# Altium project USB_HUB_VL813.PrjPcb
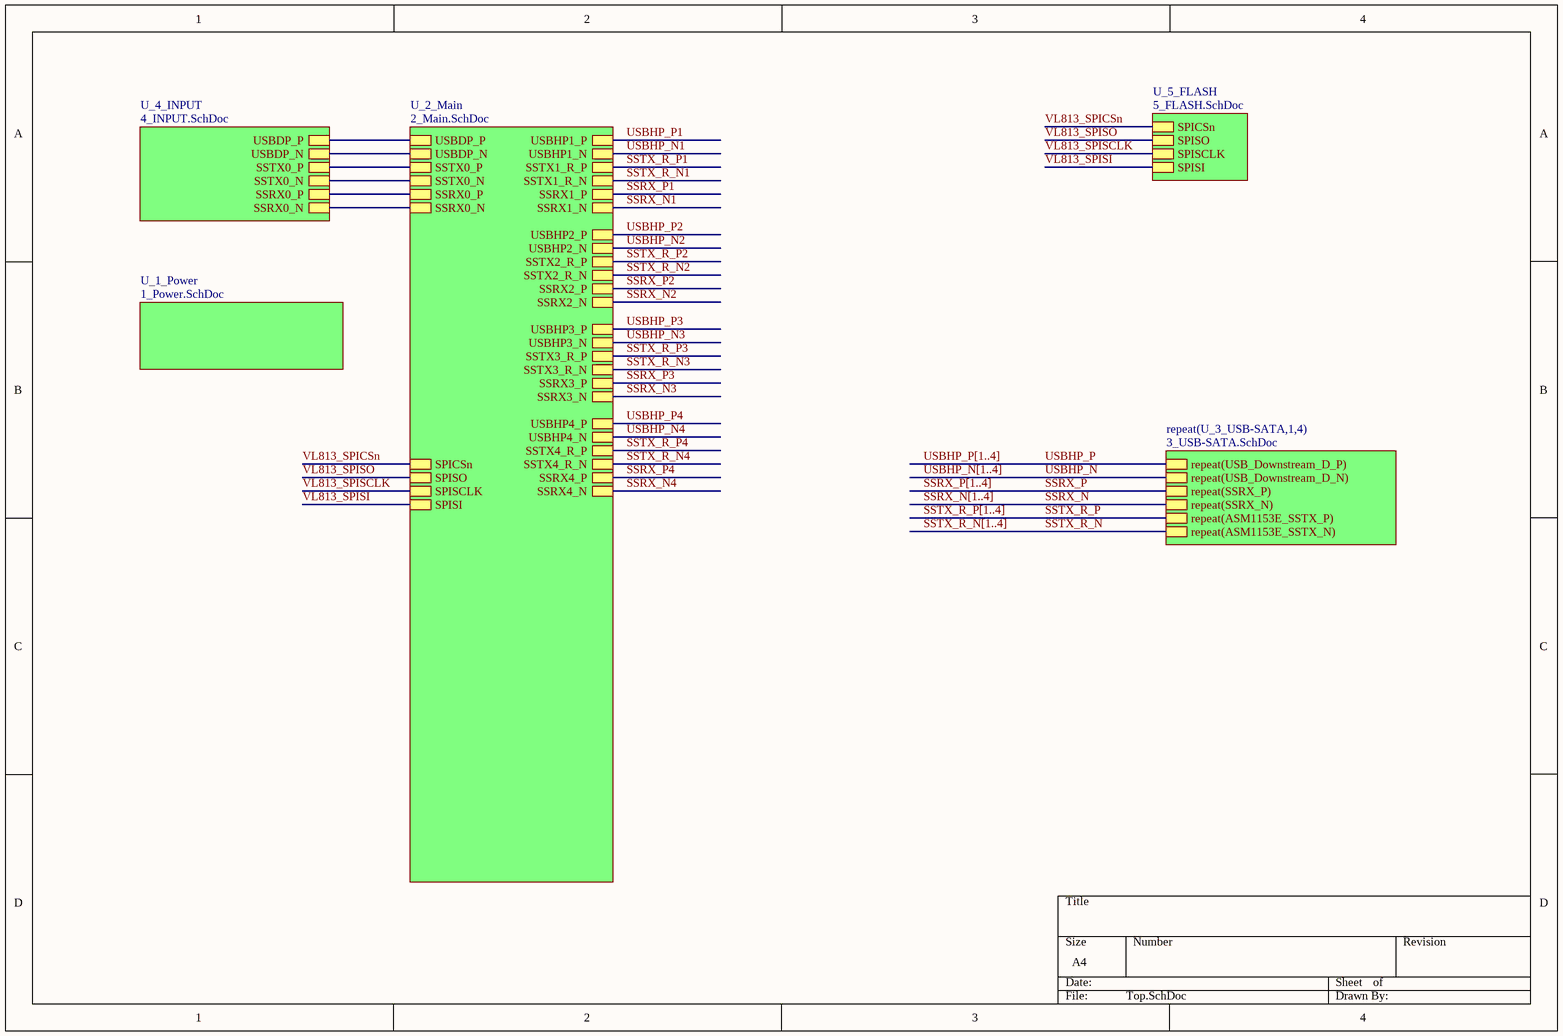
[diagram p0: Top.SchDoc]
6 sheets, 266 parts. Net scope: hierarchical (ports join the sheet entries above them; power ports are global).
Board file: USB_HUB_VL813.PcbDoc
Sheets:
  Top.SchDoc
    U_3_USB-SATA1 = 3_USB-SATA.SchDoc
    U_3_USB-SATA2 = 3_USB-SATA.SchDoc
    U_3_USB-SATA3 = 3_USB-SATA.SchDoc
    U_3_USB-SATA4 = 3_USB-SATA.SchDoc
    U_5_FLASH = 5_FLASH.SchDoc
    U_4_INPUT = 4_INPUT.SchDoc
    U_2_Main = 2_Main.SchDoc
    U_1_Power = 1_Power.SchDoc

## Sheet Top.SchDoc
size A4

### Sub-sheets
repeat(U_3_USB-SATA,1,4) = 3_USB-SATA.SchDoc: repeat(USB_Downstream_D_P), repeat(USB_Downstream_D_N), repeat(ASM1153E_SSTX_P), repeat(ASM1153E_SSTX_N), repeat(SSRX_N), repeat(SSRX_P)
U_1_Power = 1_Power.SchDoc: no entries
U_2_Main = 2_Main.SchDoc: USBHP1_N, USBHP1_P, SSRX1_N, SSRX1_P, SSTX1_R_N, SSTX1_R_P, USBHP2_N, USBHP2_P, SSRX2_N, SSRX2_P, SSTX2_R_N, SSTX2_R_P, USBHP3_N, USBHP3_P, SSRX3_N, SSRX3_P, SSTX3_R_N, SSTX3_R_P, USBHP4_N, USBHP4_P, SSRX4_N, SSRX4_P, SSTX4_R_N, SSTX4_R_P, SPICSn, SPISO, SPISCLK, SPISI, USBDP_P, USBDP_N, SSTX0_N, SSTX0_P, SSRX0_N, SSRX0_P
U_4_INPUT = 4_INPUT.SchDoc: USBDP_P, USBDP_N, SSTX0_N, SSTX0_P, SSRX0_N, SSRX0_P
U_5_FLASH = 5_FLASH.SchDoc: SPICSn, SPISO, SPISCLK, SPISI

### Nets
SSRX0_N: sheet U_4_INPUT/SSRX0_N, sheet U_2_Main/SSRX0_N
SSRX0_P: sheet U_4_INPUT/SSRX0_P, sheet U_2_Main/SSRX0_P
SSRX_N: sheet repeat(U_3_USB-SATA,1,4)/repeat(SSRX_N)
SSRX_P: sheet repeat(U_3_USB-SATA,1,4)/repeat(SSRX_P)
SSTX0_N: sheet U_4_INPUT/SSTX0_N, sheet U_2_Main/SSTX0_N
SSTX0_P: sheet U_4_INPUT/SSTX0_P, sheet U_2_Main/SSTX0_P
SSTX_R_N: sheet repeat(U_3_USB-SATA,1,4)/repeat(ASM1153E_SSTX_N)
SSTX_R_P: sheet repeat(U_3_USB-SATA,1,4)/repeat(ASM1153E_SSTX_P)
USBDP_N: sheet U_4_INPUT/USBDP_N, sheet U_2_Main/USBDP_N
USBDP_P: sheet U_4_INPUT/USBDP_P, sheet U_2_Main/USBDP_P
USBHP_N: sheet repeat(U_3_USB-SATA,1,4)/repeat(USB_Downstream_D_N)
USBHP_P: sheet repeat(U_3_USB-SATA,1,4)/repeat(USB_Downstream_D_P)
VL813_SPICSn: sheet U_5_FLASH/SPICSn, sheet U_2_Main/SPICSn  [project net SPICSn]
VL813_SPISCLK: sheet U_5_FLASH/SPISCLK, sheet U_2_Main/SPISCLK  [project net SPISCLK]
VL813_SPISI: sheet U_5_FLASH/SPISI, sheet U_2_Main/SPISI  [project net SPISI]
VL813_SPISO: sheet U_5_FLASH/SPISO, sheet U_2_Main/SPISO  [project net SPISO]

### Buses and harness runs
bus SSRX_N[1..4]
bus SSRX_P[1..4]
bus SSTX_R_N[1..4]
bus SSTX_R_P[1..4]
bus USBHP_N[1..4]
bus USBHP_P[1..4]

## Sheet 3_USB-SATA.SchDoc
size A2
Used 4 times, as channels U_3_USB-SATA1, U_3_USB-SATA2, U_3_USB-SATA3, U_3_USB-SATA4. Parts and nets are listed once, with the designators drawn on the sheet.
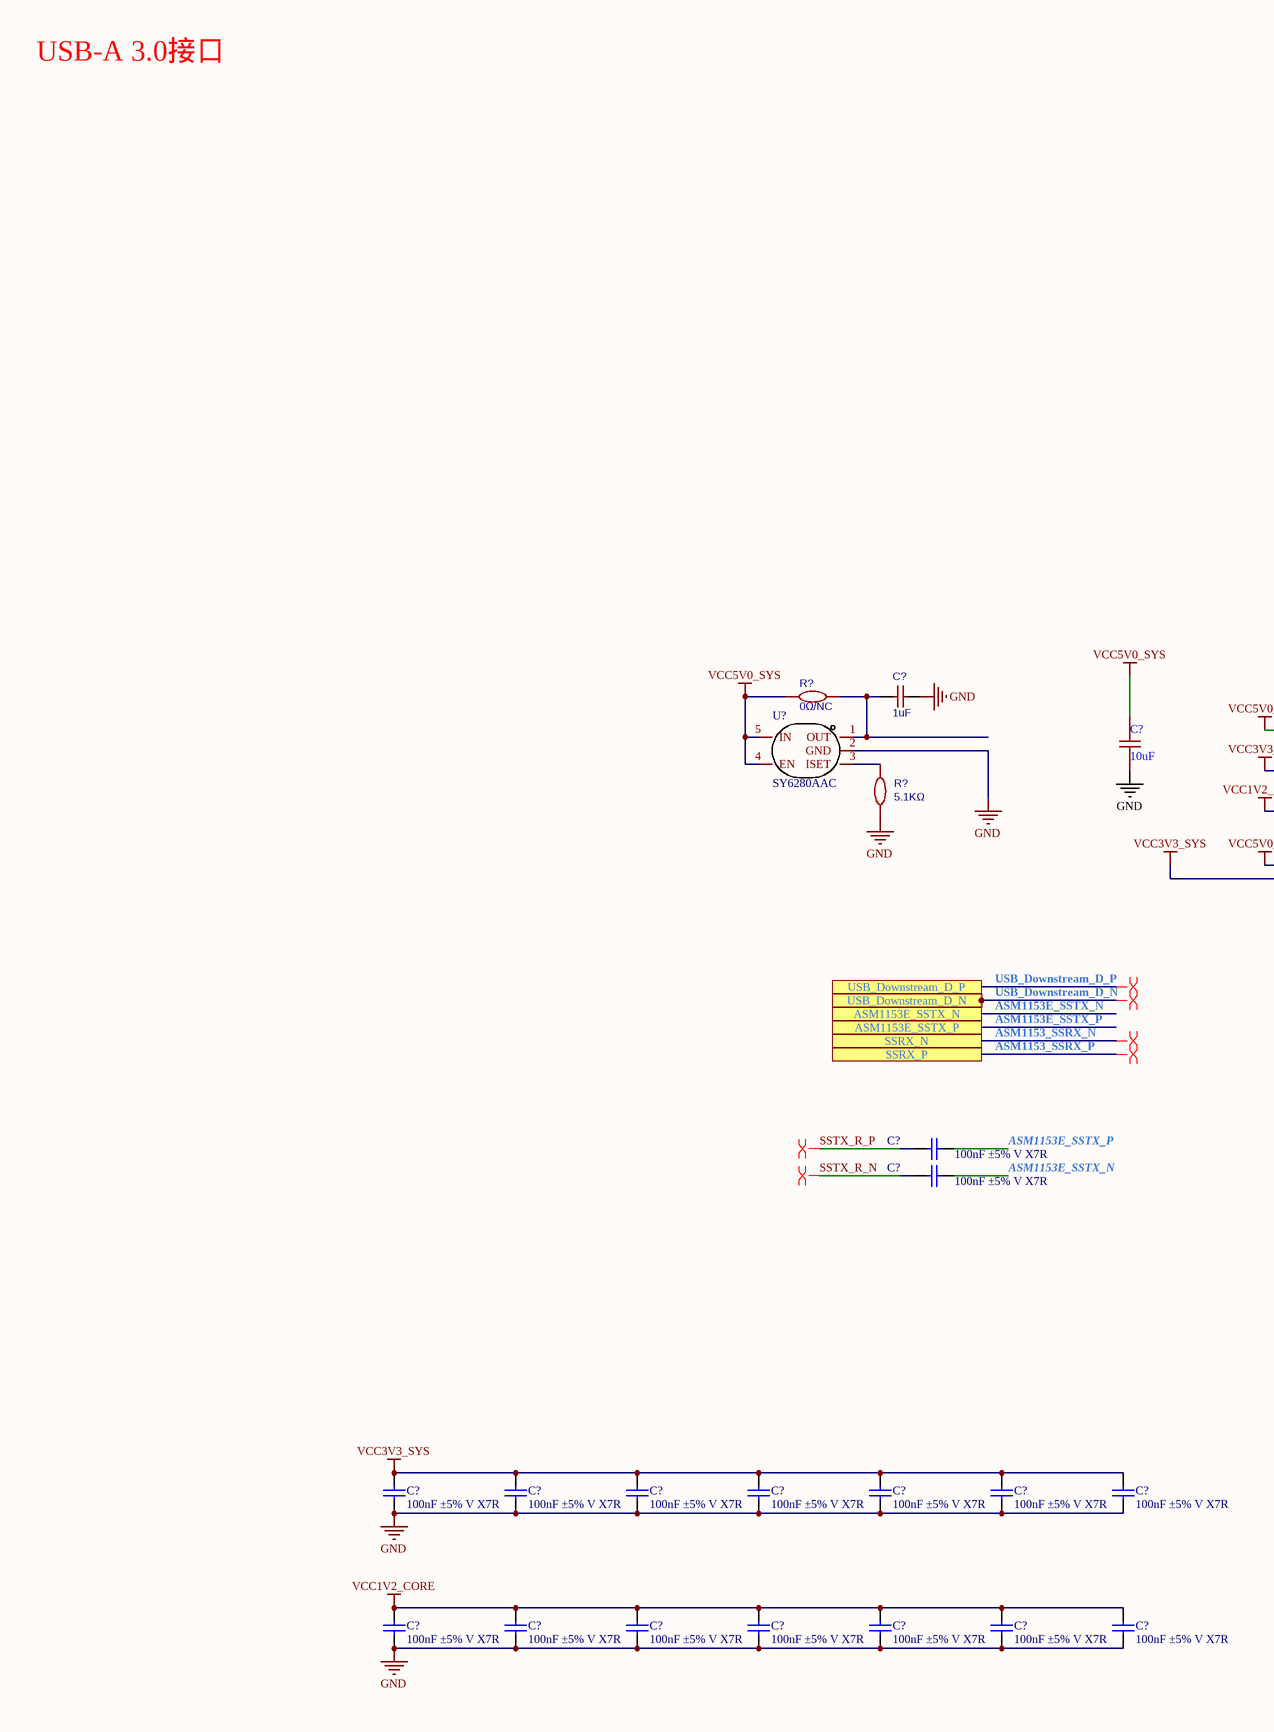
[diagram p1: 3_USB-SATA.SchDoc, left]
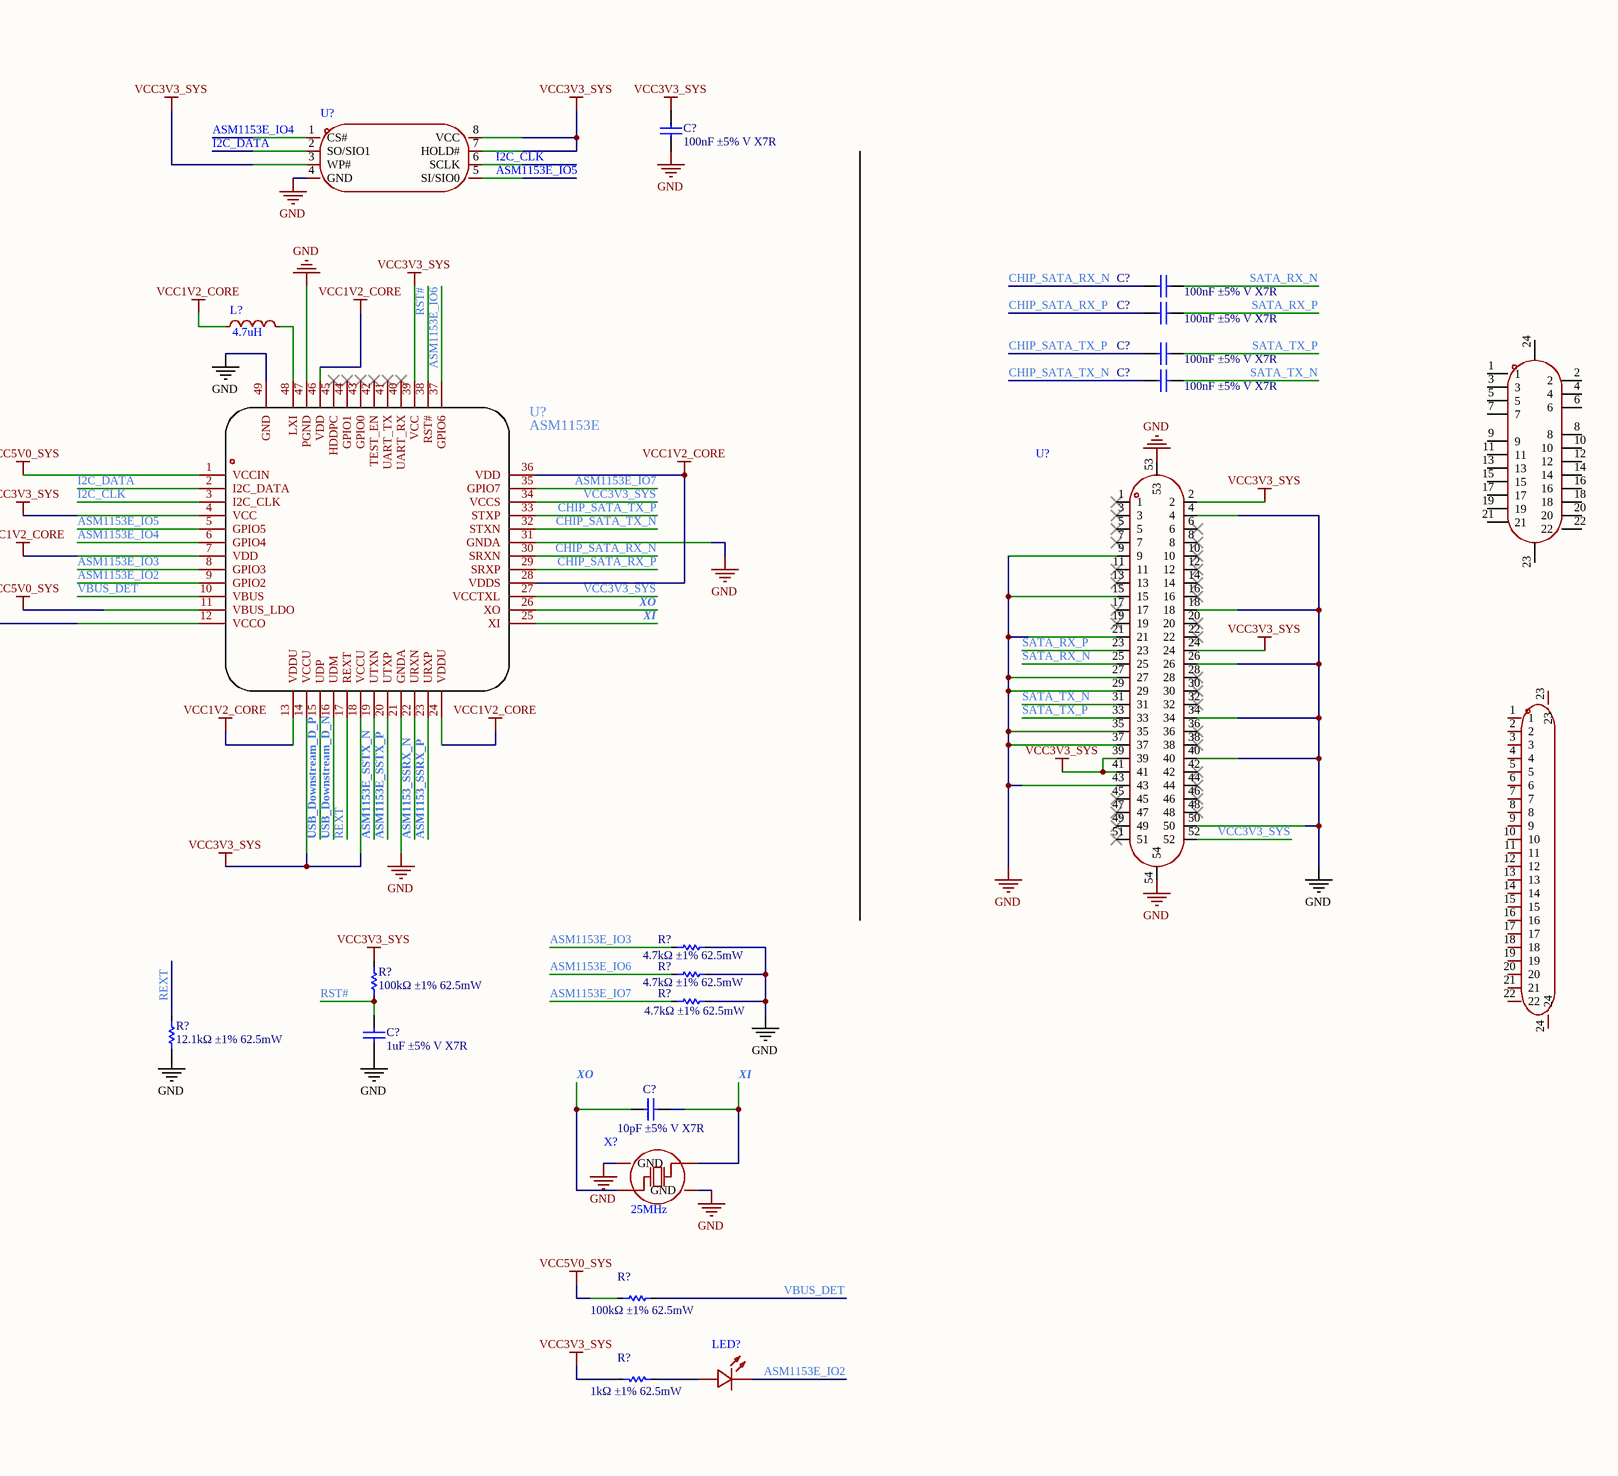
[diagram p2: 3_USB-SATA.SchDoc, right]

### Parts
(Parts that share a designator on the sheet are numbered #1, #2 ... from top to bottom, then left to right.)
C?#1  100nF ±5% V X7R  [C0402]
C?#2  100nF ±5% V X7R  [C0402]
C?#3  100nF ±5% V X7R  [C0402]
C?#4  100nF ±5% V X7R  [C0402]
C?#5  100nF ±5% V X7R  [C0402]
C?#6  1uF  [C0603]
C?#7  10uF  [C0603]
C?#8  100nF ±5% V X7R  [C0402]
C?#9  100nF ±5% V X7R  [C0402]
C?#10  1uF ±5% V X7R  [C0402]
C?#11  10pF ±5% V X7R  [C0402]
C?#12  100nF ±5% V X7R  [C0402]
C?#13  100nF ±5% V X7R  [C0402]
C?#14  100nF ±5% V X7R  [C0402]
C?#15  100nF ±5% V X7R  [C0402]
C?#16  100nF ±5% V X7R  [C0402]
C?#17  100nF ±5% V X7R  [C0402]
C?#18  100nF ±5% V X7R  [C0402]
C?#19  100nF ±5% V X7R  [C0402]
C?#20  100nF ±5% V X7R  [C0402]
C?#21  100nF ±5% V X7R  [C0402]
C?#22  100nF ±5% V X7R  [C0402]
C?#23  100nF ±5% V X7R  [C0402]
C?#24  100nF ±5% V X7R  [C0402]
C?#25  100nF ±5% V X7R  [C0402]
J?#1  HDGCYLSY-SATA-113  [CONN-TH_HDGCYLSY-SATA-113]  (value not drawn)
J?#2  XUTS-2218-0127  [CONN-SMD_SATA7-15-LT]  (value not drawn)
L?  4.7uH  [IND-SMD_L3.0-W3.0-1]
LED?  VLMW1500-GS08  [LED0402-R-RD_WHITE]  (value not drawn)
R?#1  0Ω/NC  [R0603]
R?#2  5.1KΩ  [R0603]
R?#3  4.7kΩ ±1% 62.5mW  [R0402]
R?#4  4.7kΩ ±1% 62.5mW  [R0402]
R?#5  100kΩ ±1% 62.5mW  [R0402]
R?#6  4.7kΩ ±1% 62.5mW  [R0402]
R?#7  12.1kΩ ±1% 62.5mW  [R0402]
R?#8  100kΩ ±1% 62.5mW  [R0402]
R?#9  1kΩ ±1% 62.5mW  [R0402]
U?#1  MX25L512EMI-10G  [SOP-8_L5.0-W4.0-P1.27-LS6.0-BL]  (value not drawn)
U?#2  SY6280AAC  [SOT-23-5_L3.0-W1.7-P0.95-LS2.8-BR]
U?#3  PCIE-52P70H  [PCIE-SMD_52P-P0.80_PCIE-52PXXH]  (value not drawn)
U?#4  ASM1153E  [QFN-48_L6.0-W6.0-P0.40-BL-EP4.2]
X?  25MHz  [CRYSTAL-SMD_4P-L3.2-W2.5-BL]

### Ports
ASM1153E_SSTX_N, ASM1153E_SSTX_P, SSRX_N, SSRX_P, USB_Downstream_D_N, USB_Downstream_D_P

### Nets
GND: C?#1.1 C?#6.1 C?#7.1 C?#10.1 C?#12.1 C?#13.1 C?#14.1 C?#15.1 C?#16.1 C?#17.1 C?#18.1 C?#19.1 C?#20.1 C?#21.1 C?#22.1 C?#23.1 C?#24.1 C?#25.1 R?#2.2 R?#3.1 R?#4.1 R?#6.1 R?#7.1 U?#1.4(GND) U?#2.2(GND) U?#3.4 U?#3.9 U?#3.15 U?#3.18 U?#3.21 U?#3.26 U?#3.27 U?#3.29 U?#3.34 U?#3.35 U?#3.37 U?#3.40 U?#3.43 U?#3.50 U?#3.53 U?#3.54 U?#4.21(GNDA) U?#4.31(GNDA) U?#4.47(PGND) U?#4.49(GND) X?.2(GND) X?.4(GND)
VCC1V2_CORE: C?#19.2 C?#20.2 C?#21.2 C?#22.2 C?#23.2 C?#24.2 C?#25.2 L?.1 U?#4.7(VDD) U?#4.13(VDDU) U?#4.24(VDDU) U?#4.28(VDDS) U?#4.36(VDD) U?#4.46(VDD)
VCC3V3_SYS: C?#1.2 C?#12.2 C?#13.2 C?#14.2 C?#15.2 C?#16.2 C?#17.2 C?#18.2 R?#5.2 R?#9.1 U?#1.3(WP#) U?#1.7(HOLD#) U?#1.8(VCC) U?#3.2 U?#3.24 U?#3.39 U?#3.41 U?#3.52 U?#4.4(VCC) U?#4.12(VCCO) U?#4.14(VCCU) U?#4.18(VCCU) U?#4.27(VCCTXL) U?#4.34(VCCS) U?#4.39(VCC)
VCC5V0_SYS: C?#7.2 R?#1.1 R?#8.2 U?#2.4(EN) U?#2.5(IN) U?#4.1(VCCIN) U?#4.11(VBUS_LDO)
ASM1153_SSRX_N: U?#4.22(URXN) ; port SSRX_N
ASM1153_SSRX_P: U?#4.23(URXP) ; port SSRX_P
ASM1153E_IO2: LED?.2(K) U?#4.9(GPIO2)
ASM1153E_IO3: R?#3.2 U?#4.8(GPIO3)
ASM1153E_IO4: U?#1.1(CS#) U?#4.6(GPIO4)
ASM1153E_IO5: U?#1.5(SI/SIO0) U?#4.5(GPIO5)
ASM1153E_IO6: R?#4.2 U?#4.37(GPIO6)
ASM1153E_IO7: R?#6.2 U?#4.35(GPIO7)
ASM1153E_SSTX_N: C?#9.1 U?#4.19(UTXN) ; port ASM1153E_SSTX_N
ASM1153E_SSTX_P: C?#8.1 U?#4.20(UTXP) ; port ASM1153E_SSTX_P
CHIP_SATA_RX_N: C?#2.2 U?#4.30(SRXN)
CHIP_SATA_RX_P: C?#3.2 U?#4.29(SRXP)
CHIP_SATA_TX_N: C?#5.2 U?#4.32(STXN)
CHIP_SATA_TX_P: C?#4.2 U?#4.33(STXP)
I2C_CLK: U?#1.6(SCLK) U?#4.3(I2C_CLK)
I2C_DATA: U?#1.2(SO/SIO1) U?#4.2(I2C_DATA)
REXT: R?#7.2 U?#4.17(REXT)
RST#: C?#10.2 R?#5.1 U?#4.38(RST#)
SATA_RX_N: C?#2.1 U?#3.25
SATA_RX_P: C?#3.1 U?#3.23
SATA_TX_N: C?#5.1 U?#3.31
SATA_TX_P: C?#4.1 U?#3.33
SSTX_R_N: C?#9.2
SSTX_R_P: C?#8.2
USB_Downstream_D_N: U?#4.16(UDM) ; port USB_Downstream_D_N
USB_Downstream_D_P: U?#4.15(UDP) ; port USB_Downstream_D_P
VBUS_DET: R?#8.1 U?#4.10(VBUS)
XI: C?#11.1 U?#4.25(XI) X?.3(OSC2)
XO: C?#11.2 U?#4.26(XO) X?.1(OSC1)
NetC?#6_2: C?#6.2 R?#1.2 U?#2.1(OUT)
NetL?_2: L?.2 U?#4.48(LXI)
NetLED?_1: LED?.1(A) R?#9.2
NetR?#2_1: R?#2.1 U?#2.3(ISET)

Not connected (* = marked no-connect by the designer): J?#1 1 2 3 4 5 6 7 8 9 10 11 12 13 14 15 16 17 18 19 20 21 22 23 24; J?#2 1 2 3 4 5 6 7 8 9 10 11 12 13 14 15 16 17 18 19 20 21 22 23 24; U?#3 1* 3* 5* 6* 7* 8* 10* 11* 12* 13* 14* 16* 17* 19* 20* 22* 28* 30* 32* 36* 38* 42* 44* 45* 46* 47* 48* 49* 51*; U?#4 40(UART_RX)* 41(UART_TX)* 42(TEST_EN)* 43(GPIO0)* 44(GPIO1)* 45(HDDPC)*

### Channels
U_3_USB-SATA1: designators C?=C?_U_3_USB-SATA1#6 C?=C?_U_3_USB-SATA1#7 C?=C?_U_3_USB-SATA1#15 C?=C?_U_3_USB-SATA1#16 C?=C?_U_3_USB-SATA1#17 C?=C?_U_3_USB-SATA1#18 C?=C?_U_3_USB-SATA1#12 C?=C?_U_3_USB-SATA1#13 C?=C?_U_3_USB-SATA1#14 C?=C?_U_3_USB-SATA1#23 C?=C?_U_3_USB-SATA1#24 C?=C?_U_3_USB-SATA1#25 C?=C?_U_3_USB-SATA1#20 C?=C?_U_3_USB-SATA1#21 C?=C?_U_3_USB-SATA1#22 C?=C?_U_3_USB-SATA1#19 C?=C?_U_3_USB-SATA1#8 C?=C?_U_3_USB-SATA1#9 C?=C?_U_3_USB-SATA1#10 C?=C?_U_3_USB-SATA1#11 C?=C?_U_3_USB-SATA1#2 C?=C?_U_3_USB-SATA1#3 C?=C?_U_3_USB-SATA1#4 C?=C?_U_3_USB-SATA1#5 C?=C?_U_3_USB-SATA1#1 J?=J?_U_3_USB-SATA1#1 J?=J?_U_3_USB-SATA1#2 L?=L?_U_3_USB-SATA1 LED?=LED?_U_3_USB-SATA1 R?=R?_U_3_USB-SATA1#2 R?=R?_U_3_USB-SATA1#1 R?=R?_U_3_USB-SATA1#7 R?=R?_U_3_USB-SATA1#5 R?=R?_U_3_USB-SATA1#3 R?=R?_U_3_USB-SATA1#4 R?=R?_U_3_USB-SATA1#6 R?=R?_U_3_USB-SATA1#8 R?=R?_U_3_USB-SATA1#9 U?=U?_U_3_USB-SATA1#2 U?=U?_U_3_USB-SATA1#3 U?=U?_U_3_USB-SATA1#4 U?=U?_U_3_USB-SATA1#1 X?=X?_U_3_USB-SATA1; ports ASM1153E_SSTX_N=ASM1153E_SSTX_N ASM1153E_SSTX_P=ASM1153E_SSTX_P SSRX_N=ASM1153_SSRX_N SSRX_P=ASM1153_SSRX_P USB_Downstream_D_N=USB_Downstream_D_N USB_Downstream_D_P=USB_Downstream_D_P
U_3_USB-SATA2: designators C?=C?_U_3_USB-SATA2#6 C?=C?_U_3_USB-SATA2#7 C?=C?_U_3_USB-SATA2#15 C?=C?_U_3_USB-SATA2#16 C?=C?_U_3_USB-SATA2#17 C?=C?_U_3_USB-SATA2#18 C?=C?_U_3_USB-SATA2#12 C?=C?_U_3_USB-SATA2#13 C?=C?_U_3_USB-SATA2#14 C?=C?_U_3_USB-SATA2#23 C?=C?_U_3_USB-SATA2#24 C?=C?_U_3_USB-SATA2#25 C?=C?_U_3_USB-SATA2#20 C?=C?_U_3_USB-SATA2#21 C?=C?_U_3_USB-SATA2#22 C?=C?_U_3_USB-SATA2#19 C?=C?_U_3_USB-SATA2#8 C?=C?_U_3_USB-SATA2#9 C?=C?_U_3_USB-SATA2#10 C?=C?_U_3_USB-SATA2#11 C?=C?_U_3_USB-SATA2#2 C?=C?_U_3_USB-SATA2#3 C?=C?_U_3_USB-SATA2#4 C?=C?_U_3_USB-SATA2#5 C?=C?_U_3_USB-SATA2#1 J?=J?_U_3_USB-SATA2#1 J?=J?_U_3_USB-SATA2#2 L?=L?_U_3_USB-SATA2 LED?=LED?_U_3_USB-SATA2 R?=R?_U_3_USB-SATA2#2 R?=R?_U_3_USB-SATA2#1 R?=R?_U_3_USB-SATA2#7 R?=R?_U_3_USB-SATA2#5 R?=R?_U_3_USB-SATA2#3 R?=R?_U_3_USB-SATA2#4 R?=R?_U_3_USB-SATA2#6 R?=R?_U_3_USB-SATA2#8 R?=R?_U_3_USB-SATA2#9 U?=U?_U_3_USB-SATA2#2 U?=U?_U_3_USB-SATA2#3 U?=U?_U_3_USB-SATA2#4 U?=U?_U_3_USB-SATA2#1 X?=X?_U_3_USB-SATA2; ports ASM1153E_SSTX_N=ASM1153E_SSTX_N ASM1153E_SSTX_P=ASM1153E_SSTX_P SSRX_N=ASM1153_SSRX_N SSRX_P=ASM1153_SSRX_P USB_Downstream_D_N=USB_Downstream_D_N USB_Downstream_D_P=USB_Downstream_D_P
U_3_USB-SATA3: designators C?=C?_U_3_USB-SATA3#6 C?=C?_U_3_USB-SATA3#7 C?=C?_U_3_USB-SATA3#15 C?=C?_U_3_USB-SATA3#16 C?=C?_U_3_USB-SATA3#17 C?=C?_U_3_USB-SATA3#18 C?=C?_U_3_USB-SATA3#12 C?=C?_U_3_USB-SATA3#13 C?=C?_U_3_USB-SATA3#14 C?=C?_U_3_USB-SATA3#23 C?=C?_U_3_USB-SATA3#24 C?=C?_U_3_USB-SATA3#25 C?=C?_U_3_USB-SATA3#20 C?=C?_U_3_USB-SATA3#21 C?=C?_U_3_USB-SATA3#22 C?=C?_U_3_USB-SATA3#19 C?=C?_U_3_USB-SATA3#8 C?=C?_U_3_USB-SATA3#9 C?=C?_U_3_USB-SATA3#10 C?=C?_U_3_USB-SATA3#11 C?=C?_U_3_USB-SATA3#2 C?=C?_U_3_USB-SATA3#3 C?=C?_U_3_USB-SATA3#4 C?=C?_U_3_USB-SATA3#5 C?=C?_U_3_USB-SATA3#1 J?=J?_U_3_USB-SATA3#1 J?=J?_U_3_USB-SATA3#2 L?=L?_U_3_USB-SATA3 LED?=LED?_U_3_USB-SATA3 R?=R?_U_3_USB-SATA3#2 R?=R?_U_3_USB-SATA3#1 R?=R?_U_3_USB-SATA3#7 R?=R?_U_3_USB-SATA3#5 R?=R?_U_3_USB-SATA3#3 R?=R?_U_3_USB-SATA3#4 R?=R?_U_3_USB-SATA3#6 R?=R?_U_3_USB-SATA3#8 R?=R?_U_3_USB-SATA3#9 U?=U?_U_3_USB-SATA3#2 U?=U?_U_3_USB-SATA3#3 U?=U?_U_3_USB-SATA3#4 U?=U?_U_3_USB-SATA3#1 X?=X?_U_3_USB-SATA3; ports ASM1153E_SSTX_N=ASM1153E_SSTX_N ASM1153E_SSTX_P=ASM1153E_SSTX_P SSRX_N=ASM1153_SSRX_N SSRX_P=ASM1153_SSRX_P USB_Downstream_D_N=USB_Downstream_D_N USB_Downstream_D_P=USB_Downstream_D_P
U_3_USB-SATA4: designators C?=C?_U_3_USB-SATA4#6 C?=C?_U_3_USB-SATA4#7 C?=C?_U_3_USB-SATA4#15 C?=C?_U_3_USB-SATA4#16 C?=C?_U_3_USB-SATA4#17 C?=C?_U_3_USB-SATA4#18 C?=C?_U_3_USB-SATA4#12 C?=C?_U_3_USB-SATA4#13 C?=C?_U_3_USB-SATA4#14 C?=C?_U_3_USB-SATA4#23 C?=C?_U_3_USB-SATA4#24 C?=C?_U_3_USB-SATA4#25 C?=C?_U_3_USB-SATA4#20 C?=C?_U_3_USB-SATA4#21 C?=C?_U_3_USB-SATA4#22 C?=C?_U_3_USB-SATA4#19 C?=C?_U_3_USB-SATA4#8 C?=C?_U_3_USB-SATA4#9 C?=C?_U_3_USB-SATA4#10 C?=C?_U_3_USB-SATA4#11 C?=C?_U_3_USB-SATA4#2 C?=C?_U_3_USB-SATA4#3 C?=C?_U_3_USB-SATA4#4 C?=C?_U_3_USB-SATA4#5 C?=C?_U_3_USB-SATA4#1 J?=J?_U_3_USB-SATA4#1 J?=J?_U_3_USB-SATA4#2 L?=L?_U_3_USB-SATA4 LED?=LED?_U_3_USB-SATA4 R?=R?_U_3_USB-SATA4#2 R?=R?_U_3_USB-SATA4#1 R?=R?_U_3_USB-SATA4#7 R?=R?_U_3_USB-SATA4#5 R?=R?_U_3_USB-SATA4#3 R?=R?_U_3_USB-SATA4#4 R?=R?_U_3_USB-SATA4#6 R?=R?_U_3_USB-SATA4#8 R?=R?_U_3_USB-SATA4#9 U?=U?_U_3_USB-SATA4#2 U?=U?_U_3_USB-SATA4#3 U?=U?_U_3_USB-SATA4#4 U?=U?_U_3_USB-SATA4#1 X?=X?_U_3_USB-SATA4; ports ASM1153E_SSTX_N=ASM1153E_SSTX_N ASM1153E_SSTX_P=ASM1153E_SSTX_P SSRX_N=ASM1153_SSRX_N SSRX_P=ASM1153_SSRX_P USB_Downstream_D_N=USB_Downstream_D_N USB_Downstream_D_P=USB_Downstream_D_P

### Layout directives
differential pair: ASM1153_SSRX_N, ASM1153_SSRX_P, SSTX_R_N_U_3_USB-SATA1, SSTX_R_P_U_3_USB-SATA1, USB_Downstream_D_N, USB_Downstream_D_P

### Notes on the sheet
- USB-A 3.0接口

### Library data of the parts
C?#1-C?#5 C?#8-C?#25 = C0402: Capacitor; Published: 8-Jun-2000; LatestRevisionDate: 17-Jul-2002; LatestRevisionNote: Re-released for DXP Platform.; PackageReference: RAD-0.3; Publisher: Altium Limited; PackageDescription: Radial Cap, Thru-Hole; 2 Leads; 0.3 in Pin Spacing
C?#6 = C: BOM_Manufacturer: FH; BOM_Manufacturer Part: 0603F104M500NT; nameAlias: Capacitance; BOM_Supplier: LCSC; BOM_Supplier Part: C42998; BOM_JLCPCB Part Class: Extended Part; spicePre: C; spiceSymbolName: 0603F104M500NT
C?#7 = CL10A106KP8NNNC: Manufacturer: SAMSUNG(三星); Add into BOM: yes; Tolerance: ±10%; Voltage Rated: 10V; Temperature Coefficient: X5R; Symbol: CL10A106KP8NNNC; Device: CL10A106KP8NNNC; LCSC Part Name: 10uF ±10% 10V; Supplier Part: C19702; Manufacturer Part: CL10A106KP8NNNC; Supplier Footprint: 0603; JLCPCB Part Class: Basic Part; Datasheet: https://atta.szlcsc.com/upload/public/pdf/source/20160103/1457707703378.pdf; Supplier: LCSC; Convert to PCB: yes; Value: 10uF
J?#1 = SATA-22P: Manufacturer: HDGC(华德共创); Add into BOM: yes; Interface Form: SATA; Connector Type: 母; Supplementary Features: 鱼叉脚(金属); Symbol: HDGCYLSY-SATA-113; Device: HDGCYLSY-SATA-113; LCSC Part Name: HDGCYLSY-SATA-113; Supplier Part: C22438715; Manufacturer Part: HDGCYLSY-SATA-113; Supplier Footprint: 插件; JLCPCB Part Class: Extended Part; Datasheet: https://atta.szlcsc.com/upload/public/pdf/source/20240523/CC8F1A74D84556CFB703F6AD7368385F.pdf; Supplier: LCSC; Convert to PCB: yes; Number of Pins: 22P; Mounting Style: 直插; Body Height: -; Operating Temperature Range: -
J?#2 = SATA-22P_1: Manufacturer: LX(连欣科技); Add into BOM: yes; Symbol: XUTS-2218-0127; Device: XUTS-2218-0127; LCSC Part Name: XUTS-2218-0127; Supplier Part: C19193804; Manufacturer Part: XUTS-2218-0127; Supplier Footprint: SMD,P=1.27mm; JLCPCB Part Class: Extended Part; Datasheet: https://atta.szlcsc.com/upload/public/pdf/source/20231117/B34EFEA7383D9ABF34D19E7DB42C8BB5.pdf; Supplier: LCSC; Convert to PCB: yes
L? = CKCS3012-4.7uH/M: Manufacturer: CENKER(岑科); Add into BOM: yes; Tolerance: ±20%; Rated Current: 1.24A; DC Resistance (DCR): 120mΩ; Symbol: CKCS3012-4.7UH/M; Device: CKCS3012-4.7uH/M; LCSC Part Name: 4.7uH ±20% 1.24A 120mΩ; Supplier Part: C354557; Manufacturer Part: CKCS3012-4.7uH/M; Supplier Footprint: SMD; JLCPCB Part Class: Extended Part; Datasheet: https://atta.szlcsc.com/upload/public/pdf/source/20190115/C354557_61A3705615E4FADB9C94D2137EE09B6B.pdf; Supplier: LCSC; Convert to PCB: yes; Value: 4.7uH
LED? = VLMW1500-GS08: Manufacturer: VISHAY(威世); Add into BOM: yes; Emitted Color: 白灯; Forward Current: 5mA; Forward Voltage (VF): 2.9V; Luminous Intensity: 90mcd; Power Dissipation: 70mW; Symbol: VLMW1500-GS08; Device: VLMW1500-GS08; LCSC Part Name: 白灯; Supplier Part: C511379; Manufacturer Part: VLMW1500-GS08; Supplier Footprint: 0402; JLCPCB Part Class: Extended Part; Datasheet: https://atta.szlcsc.com/upload/public/pdf/source/20200408/C511379_C2F59698F604A60E2C48FD851172BBA0.pdf; Supplier: LCSC; Convert to PCB: yes; Diode Configuration: -; Lens Color: -; Dominant Wavelength: -; Peak Wavelength: -; Color Temperature: -; Luminous Flux (@25℃): -; Viewing Angle: -; Mounting Sytle: -; Operating Temperature: -30~+80
R?#1 R?#2 = R: BOM_Manufacturer: Guangdong Fenghua Advanced Tech; BOM_Manufacturer Part: RS-03K1002FT; Resistance (Ohms): 10K; nameAlias: Resistance; Contributor: LCSC; BOM_Supplier: LCSC; BOM_Supplier Part: C115324; spicePre: R; spiceSymbolName: RS-03K1002FT
R?#3-R?#9 = R0402: Resistor; Published: 8-Jun-2000; LatestRevisionDate: 17-Jul-2002; LatestRevisionNote: Re-released for DXP Platform.; PackageReference: AXIAL-0.3; Publisher: Altium Limited; PackageDescription: Axial Device, Thru-Hole; 2 Leads; 0.3 in Pin Spacing
U?#1 = MX25L512EMI-10G: Manufacturer: MXIC(旺宏电子); Symbol: MX25L512EMI-10G_C2803023; Add into BOM: yes; Device: MX25L512EMI-10G; LCSC Part Name: MX25L512EMI-10G; Supplier Part: C2803023; Manufacturer Part: MX25L512EMI-10G; Supplier Footprint: SOP-8; JLCPCB Part Class: Extended Part; Datasheet: https://atta.szlcsc.com/upload/public/pdf/source/20210906/B454D1B9C39ED3C00F3164A690CF7DD8.pdf; Supplier: LCSC; Convert to PCB: yes
U?#3 = PCIE-52P70H: Manufacturer: XUNPU(讯普); Symbol: PCIE-52P70H_C2982554; Add into BOM: yes; Device: PCIE-52P70H; LCSC Part Name: PCIE-52P70H; Supplier Part: C2982554; Manufacturer Part: PCIE-52P70H; Supplier Footprint: SMD; JLCPCB Part Class: Extended Part; Datasheet: https://atta.szlcsc.com/upload/public/pdf/source/20220311/DC8B167F9A8E29C645B8AA97E9059897.pdf; Supplier: LCSC; Convert to PCB: yes
U?#4 = ASM1153E: USB3.0 to SATA Bridge Controller; Add into BOM: yes; Symbol: ASM1153E; Device: ASM1153E; LCSC Part Name: ASM1153E; Supplier Part: C2762919; Manufacturer Part: ASM1153E; Supplier Footprint: LQFN-48_EP_6.0x6.0x0.4P; JLCPCB Part Class: Extended Part; Datasheet: 2021-03-22/601605W/2276bd4a79cf4165b237c0c17b58d9ef/ASM1153Datasheetv1_1.pdf; Supplier: LCSC; Convert to PCB: yes
X? = X1E0000210621: Manufacturer: EPSON(爱普生); Add into BOM: yes; Crystal Type: 贴片无源晶振; Frequency Tolerance: ±10ppm; Load Capacitance: 9pF; Equivalent Series Resistance (ESR): 40Ω; Symbol: X1E0000210621; Device: X1E0000210621; LCSC Part Name: 25MHz ±10ppm 9pF; Supplier Part: C255920; Manufacturer Part: X1E0000210621; Supplier Footprint: SMD3225-4P; JLCPCB Part Class: Extended Part; Datasheet: https://atta.szlcsc.com/upload/public/pdf/source/20180822/C255920_F9528E19433D1B377CB88CCBF483E490.pdf; Supplier: LCSC; Convert to PCB: yes; Value: 25MHz; Frequency Stability: -; Operating Temperature: -40~+85

## Sheet 5_FLASH.SchDoc
size A4
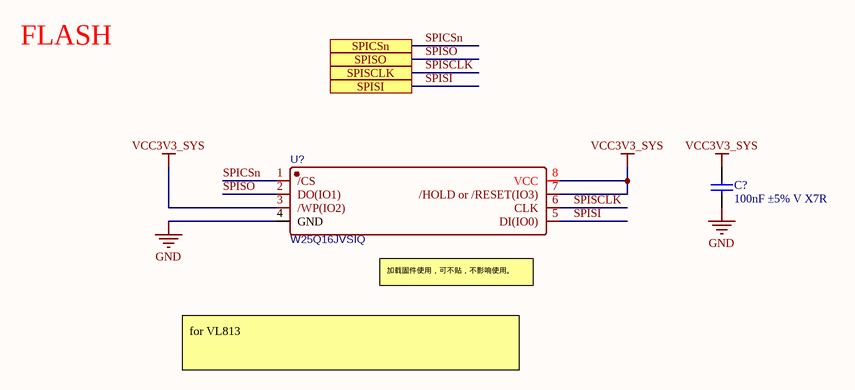
[diagram p3: 5_FLASH.SchDoc]

### Parts
(Parts that share a designator on the sheet are numbered #1, #2 ... from top to bottom, then left to right.)
C?#1  100nF ±5% V X7R  [C0402]
U?#1  W25Q16JVSIQ  [SOIC-8_L5.3-W5.3-P1.27-LS8.0-BL]

### Ports
SPICSn, SPISCLK, SPISI, SPISO

### Nets
GND: C?#1.1 U?#1.4(GND)
VCC3V3_SYS: C?#1.2 U?#1.3(/WP(IO2)) U?#1.7(/HOLD_or_/RESET(IO3)) U?#1.8(VCC)
SPICSn: U?#1.1(/CS) ; port SPICSn
SPISCLK: U?#1.6(CLK) ; port SPISCLK
SPISI: U?#1.5(DI(IO0)) ; port SPISI
SPISO: U?#1.2(DO(IO1)) ; port SPISO

### Notes on the sheet
- FLASH
- (near U?#1) 加载固件使用，可不贴，不影响使用。
- for VL813

### Library data of the parts
C?#1 = C0402: Capacitor; Published: 8-Jun-2000; LatestRevisionDate: 17-Jul-2002; LatestRevisionNote: Re-released for DXP Platform.; PackageReference: RAD-0.3; Publisher: Altium Limited; PackageDescription: Radial Cap, Thru-Hole; 2 Leads; 0.3 in Pin Spacing
U?#1 = W25Q16FWSSIQ: BOM_Manufacturer: Winbond Elec; Contributor: LCSC; BOM_Supplier: LCSC; BOM_Supplier Part: C377629; BOM_Manufacturer Part: W25Q16FWSSIQ; BOM_JLCPCB Part Class: Extended Part; spicePre: U; spiceSymbolName: W25Q16FWSSIQ

## Sheet 4_INPUT.SchDoc
size A4
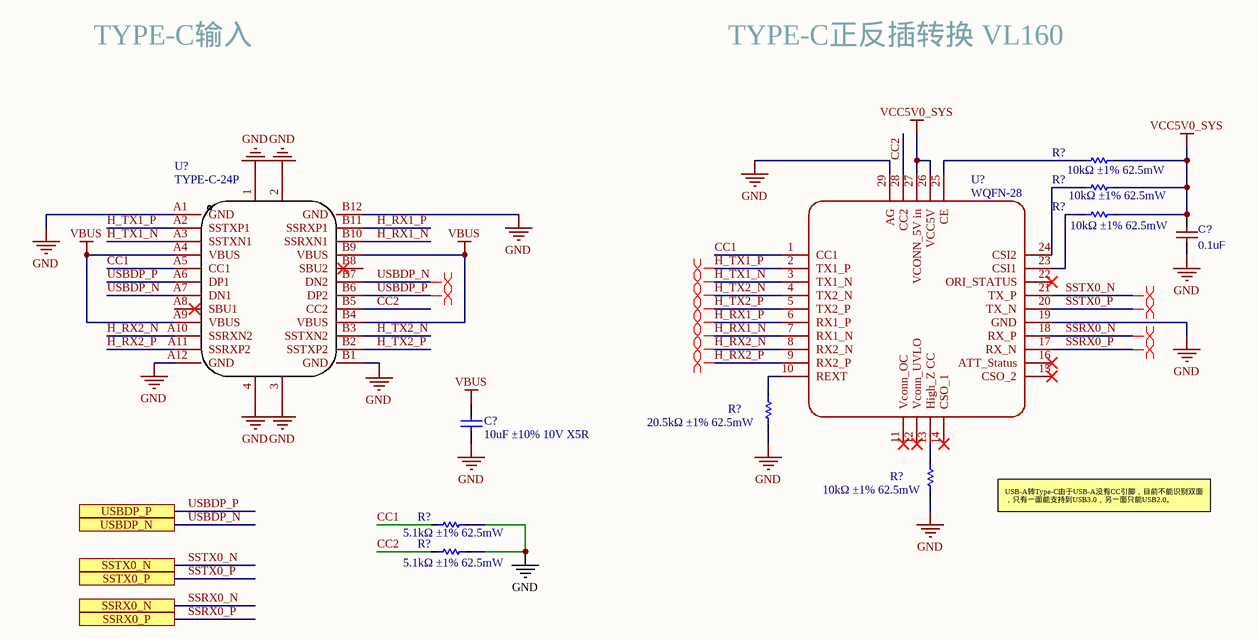
[diagram p4: 4_INPUT.SchDoc]

### Parts
(Parts that share a designator on the sheet are numbered #1, #2 ... from top to bottom, then left to right.)
C?#2  0.1uF  [C0603]
C?#3  10uF ±10% 10V X5R  [C0603]
R?#1  10kΩ ±1% 62.5mW  [R0402]
R?#2  10kΩ ±1% 62.5mW  [R0402]
R?#3  10kΩ ±1% 62.5mW  [R0402]
R?#4  20.5kΩ ±1% 62.5mW  [R0402]
R?#5  10kΩ ±1% 62.5mW  [R0402]
R?#6  5.1kΩ ±1% 62.5mW  [R0402]
R?#7  5.1kΩ ±1% 62.5mW  [R0402]
U?#2  TYPE-C-24P  [TYPE-C-24P]
U?#3  WQFN-28  [WQFN-28]

### Ports
SSRX0_N, SSRX0_P, SSTX0_N, SSTX0_P, USBDP_N, USBDP_P

### Nets
GND: C?#2.2 C?#3.1 R?#4.2 R?#5.2 R?#6.1 R?#7.1 U?#2.1 U?#2.2 U?#2.3 U?#2.4 U?#2.A1(GND) U?#2.A12(GND) U?#2.B1(GND) U?#2.B12(GND) U?#3.19(GND) U?#3.29(AG)
VBUS: C?#3.2 U?#2.A4(VBUS) U?#2.A9(VBUS) U?#2.B4(VBUS) U?#2.B9(VBUS)
VCC5V0_SYS: C?#2.1 R?#1.2 R?#2.2 R?#3.2 U?#3.26(VCC5V) U?#3.27(VCONN_5V_in)
CC1: R?#6.2 U?#2.A5(CC1) U?#3.1(CC1)
CC2: R?#7.2 U?#2.B5(CC2) U?#3.28(CC2)
H_RX1_N: U?#2.B10(SSRXN1) U?#3.7(RX1_N)
H_RX1_P: U?#2.B11(SSRXP1) U?#3.6(RX1_P)
H_RX2_N: U?#2.A10(SSRXN2) U?#3.8(RX2_N)
H_RX2_P: U?#2.A11(SSRXP2) U?#3.9(RX2_P)
H_TX1_N: U?#2.A3(SSTXN1) U?#3.3(TX1_N)
H_TX1_P: U?#2.A2(SSTXP1) U?#3.2(TX1_P)
H_TX2_N: U?#2.B3(SSTXN2) U?#3.4(TX2_N)
H_TX2_P: U?#2.B2(SSTXP2) U?#3.5(TX2_P)
SSRX0_N: U?#3.18(RX_P) ; port SSRX0_N
SSRX0_P: U?#3.17(RX_N) ; port SSRX0_P
SSTX0_N: U?#3.21(TX_P) ; port SSTX0_N
SSTX0_P: U?#3.20(TX_N) ; port SSTX0_P
USBDP_N: U?#2.A7(DN1) U?#2.B7(DN2) ; port USBDP_N
USBDP_P: U?#2.A6(DP1) U?#2.B6(DP2) ; port USBDP_P
NetR?#1_1: R?#1.1 U?#3.25(CE)
NetR?#2_1: R?#2.1 U?#3.24(CSI2)
NetR?#3_1: R?#3.1 U?#3.23(CSI1)
NetR?#4_1: R?#4.1 U?#3.10(REXT)
NetR?#5_1: R?#5.1 U?#3.13(High_Z_CC)

Not connected (* = marked no-connect by the designer): U?#2 A8(SBU1) B8(SBU2); U?#3 11(Vconn_OC)* 12(Vconn_UVLO)* 14(CSO_1)* 15(CSO_2)* 16(ATT_Status)* 22(ORI_STATUS)*

### Layout directives
differential pair: H_RX1_N, H_RX1_P, H_RX2_N, H_RX2_P, H_TX1_N, H_TX1_P, H_TX2_N, H_TX2_P, SSRX0_N, SSRX0_P, SSTX0_N, SSTX0_P, USBDP_N, USBDP_P

### Notes on the sheet
- TYPE-C输入
- TYPE-C正反插转换 VL160
- USB-A转Type-C由于USB-A没有CC引脚，目前不能识别双面，只有一面能支持到USB3.0，另一面只能USB2.0。

### Library data of the parts
C?#2 = C: as C?#6 on sheet 3_USB-SATA; BOM_Supplier: LCSC; BOM_Supplier Part: C42998; BOM_JLCPCB Part Class: Extended Part; spicePre: C; spiceSymbolName: 0603F104M500NT
C?#3 = C0603: Capacitor; Published: 8-Jun-2000; LatestRevisionDate: 17-Jul-2002; LatestRevisionNote: Re-released for DXP Platform.; PackageReference: RAD-0.3; Publisher: Altium Limited; PackageDescription: Radial Cap, Thru-Hole; 2 Leads; 0.3 in Pin Spacing
R?#1-R?#7 = R0402: Resistor; Published: 8-Jun-2000; LatestRevisionDate: 17-Jul-2002; LatestRevisionNote: Re-released for DXP Platform.; PackageReference: AXIAL-0.3; Publisher: Altium Limited; PackageDescription: Axial Device, Thru-Hole; 2 Leads; 0.3 in Pin Spacing
U?#3 = VL160
U?#2 = TYPE-C-24P: Parameter 1: *

## Sheet 2_Main.SchDoc
size A3
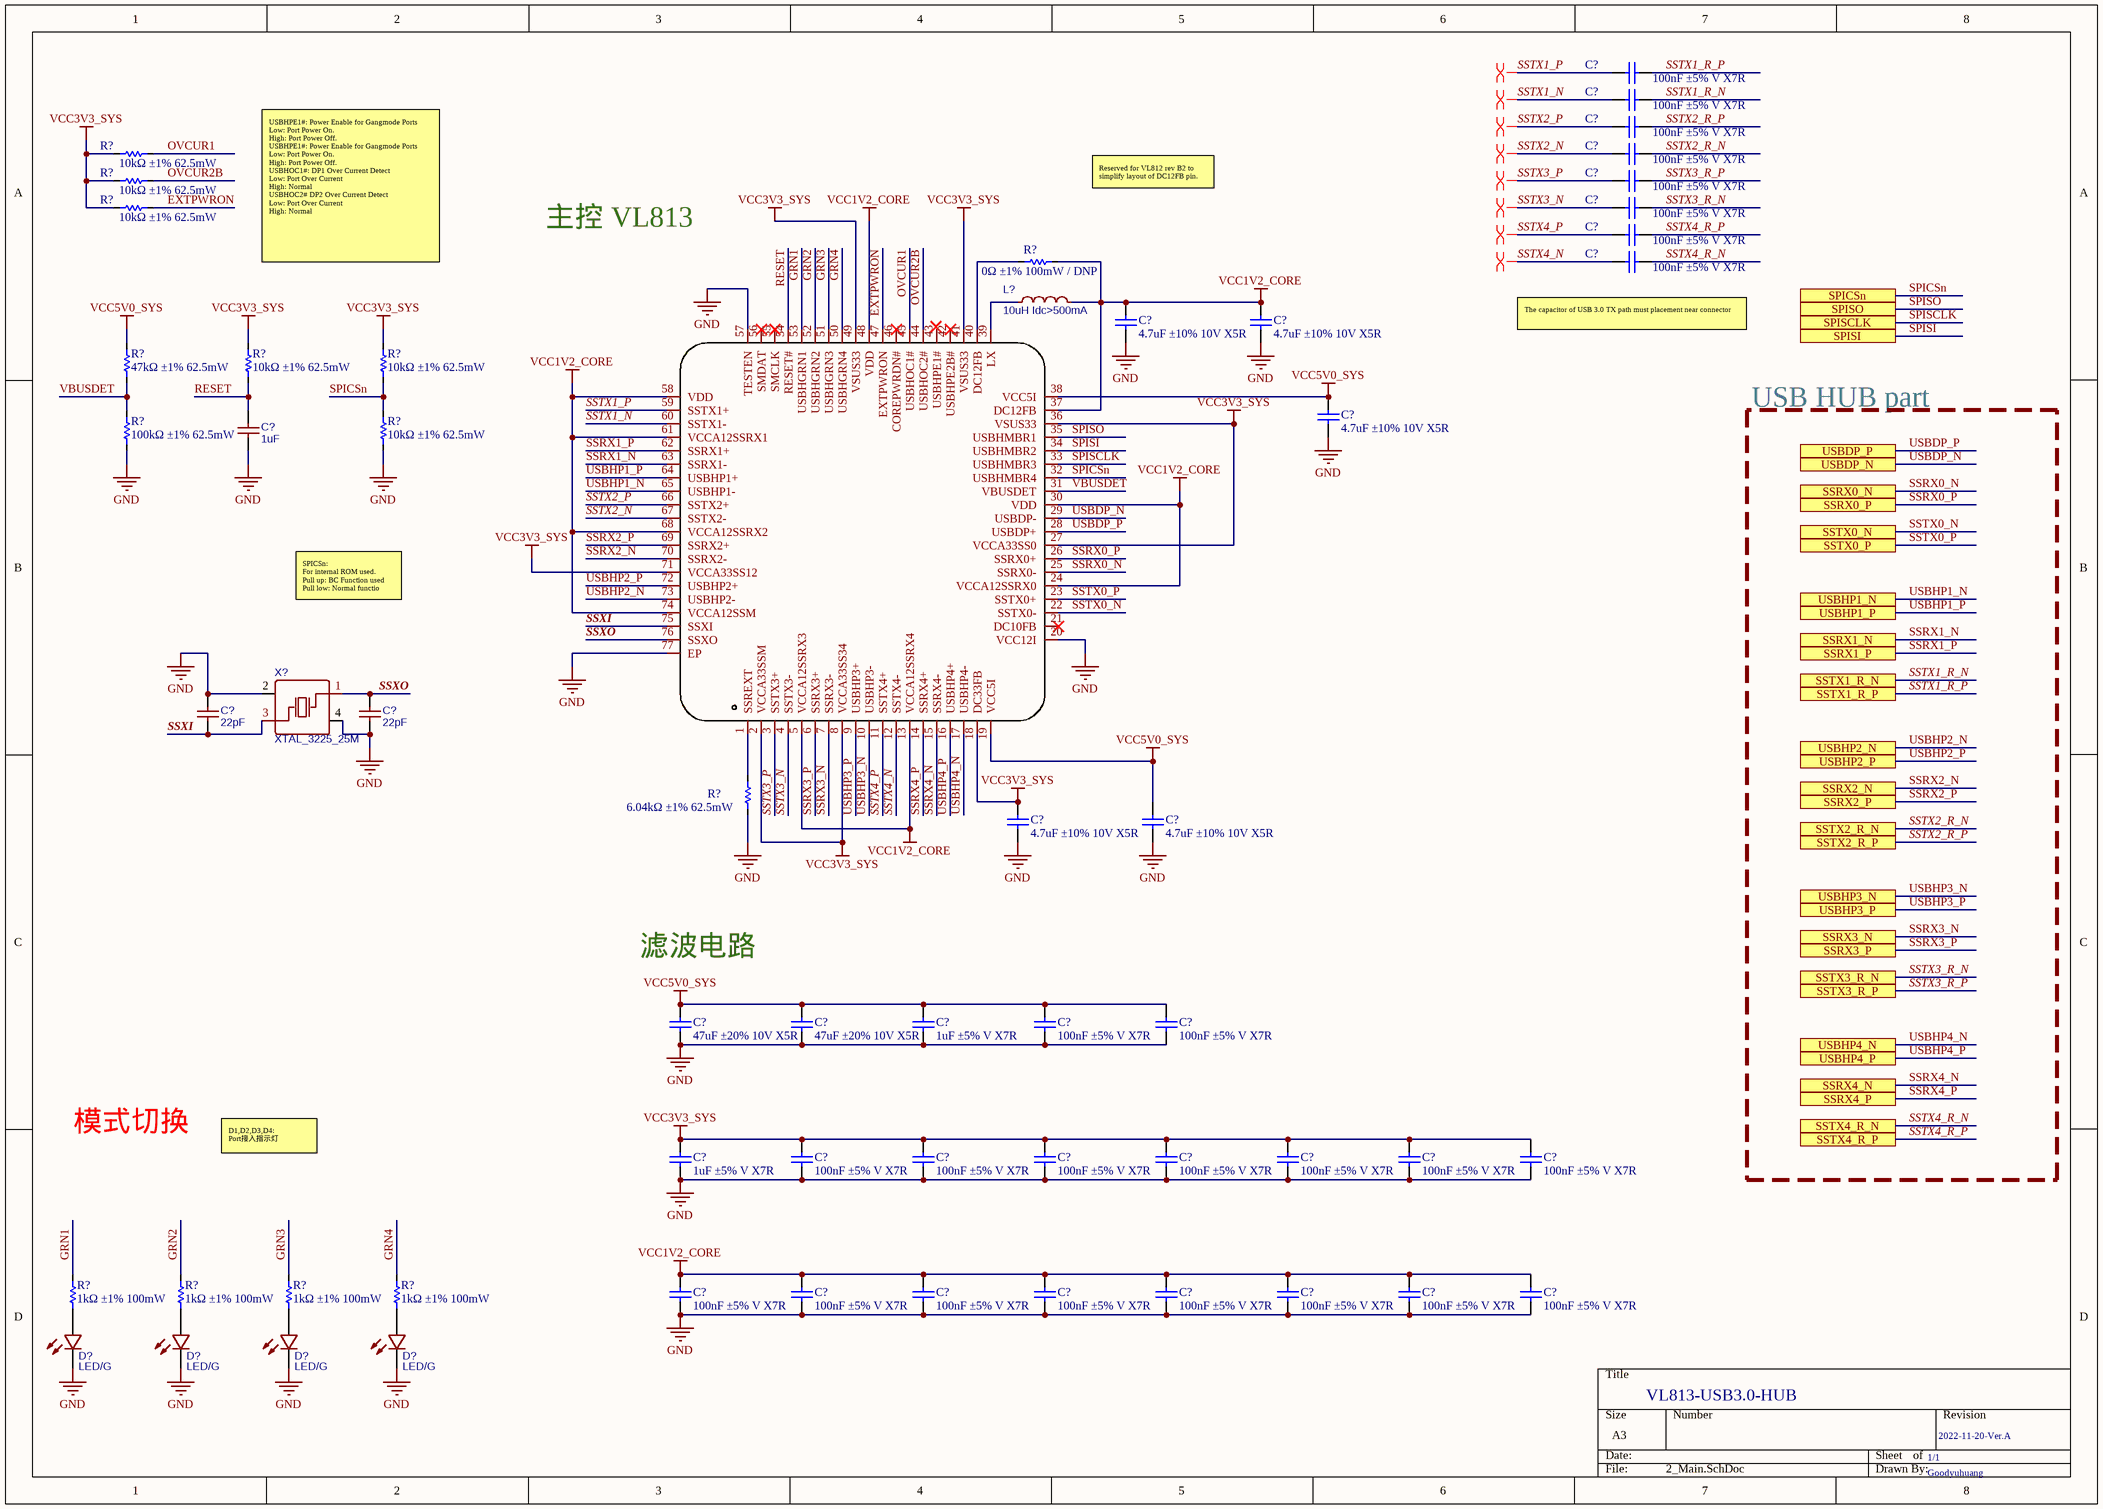
[diagram p5: 2_Main.SchDoc]

### Parts
(Parts that share a designator on the sheet are numbered #1, #2 ... from top to bottom, then left to right.)
C?#4  100nF ±5% V X7R  [C0402]
C?#5  100nF ±5% V X7R  [C0402]
C?#6  100nF ±5% V X7R  [C0402]
C?#7  100nF ±5% V X7R  [C0402]
C?#8  100nF ±5% V X7R  [C0402]
C?#9  100nF ±5% V X7R  [C0402]
C?#10  100nF ±5% V X7R  [C0402]
C?#11  100nF ±5% V X7R  [C0402]
C?#12  4.7uF ±10% 10V X5R  [C0603]
C?#13  4.7uF ±10% 10V X5R  [C0603]
C?#14  4.7uF ±10% 10V X5R  [C0603]
C?#15  1uF  [C0603]
C?#16  22pF  [C0603]
C?#17  22pF  [C0603]
C?#18  4.7uF ±10% 10V X5R  [C0603]
C?#19  4.7uF ±10% 10V X5R  [C0603]
C?#20  47uF ±20% 10V X5R  [C1206]
C?#21  47uF ±20% 10V X5R  [C1206]
C?#22  1uF ±5% V X7R  [C0402]
C?#23  100nF ±5% V X7R  [C0402]
C?#24  100nF ±5% V X7R  [C0402]
C?#25  1uF ±5% V X7R  [C0402]
C?#26  100nF ±5% V X7R  [C0402]
C?#27  100nF ±5% V X7R  [C0402]
C?#28  100nF ±5% V X7R  [C0402]
C?#29  100nF ±5% V X7R  [C0402]
C?#30  100nF ±5% V X7R  [C0402]
C?#31  100nF ±5% V X7R  [C0402]
C?#32  100nF ±5% V X7R  [C0402]
C?#33  100nF ±5% V X7R  [C0402]
C?#34  100nF ±5% V X7R  [C0402]
C?#35  100nF ±5% V X7R  [C0402]
C?#36  100nF ±5% V X7R  [C0402]
C?#37  100nF ±5% V X7R  [C0402]
C?#38  100nF ±5% V X7R  [C0402]
C?#39  100nF ±5% V X7R  [C0402]
C?#40  100nF ±5% V X7R  [C0402]
D?#1  LED/G  [LED0805-R-RD]
D?#2  LED/G  [LED0805-R-RD]
D?#3  LED/G  [LED0805-R-RD]
D?#4  LED/G  [LED0805-R-RD]
L?  10uH Idc>500mA  [Inductor]
R?#8  10kΩ ±1% 62.5mW  [R0402]
R?#9  10kΩ ±1% 62.5mW  [R0402]
R?#10  10kΩ ±1% 62.5mW  [R0402]
R?#11  0Ω ±1% 100mW / DNP  [R0603]
R?#12  47kΩ ±1% 62.5mW  [R0402]
R?#13  10kΩ ±1% 62.5mW  [R0402]
R?#14  10kΩ ±1% 62.5mW  [R0402]
R?#15  100kΩ ±1% 62.5mW  [R0402]
R?#16  10kΩ ±1% 62.5mW  [R0402]
R?#17  6.04kΩ ±1% 62.5mW  [R0402]
R?#18  1kΩ ±1% 100mW  [R0603]
R?#19  1kΩ ±1% 100mW  [R0603]
R?#20  1kΩ ±1% 100mW  [R0603]
R?#21  1kΩ ±1% 100mW  [R0603]
U?#4  VL813(A1)  [QFN-76]  (value not drawn)
X?  XTAL_3225_25M  [OSC-SMD_4P-L3.2-W2.5-BL_SIT8008BI]

### Ports
SPICSn, SPISCLK, SPISI, SPISO, SSRX0_N, SSRX0_P, SSRX1_N, SSRX1_P, SSRX2_N, SSRX2_P, SSRX3_N, SSRX3_P, SSRX4_N, SSRX4_P, SSTX0_N, SSTX0_P, SSTX1_R_N, SSTX1_R_P, SSTX2_R_N, SSTX2_R_P, SSTX3_R_N, SSTX3_R_P, SSTX4_R_N, SSTX4_R_P, USBDP_N, USBDP_P, USBHP1_N, USBHP1_P, USBHP2_N, USBHP2_P, USBHP3_N, USBHP3_P, USBHP4_N, USBHP4_P

### Nets
GND: C?#12.1 C?#13.1 C?#14.1 C?#15.2 C?#16.2 C?#17.2 C?#18.1 C?#19.1 C?#20.1 C?#21.1 C?#22.1 C?#23.1 C?#24.1 C?#25.1 C?#26.1 C?#27.1 C?#28.1 C?#29.1 C?#30.1 C?#31.1 C?#32.1 C?#33.1 C?#34.1 C?#35.1 C?#36.1 C?#37.1 C?#38.1 C?#39.1 C?#40.1 D?#1.2(C) D?#2.2(C) D?#3.2(C) D?#4.2(C) R?#15.1 R?#16.1 R?#17.1 U?#4.20(VCC12I) U?#4.57(TESTEN) U?#4.77(EP) X?.2(GND) X?.4(GND)
VCC1V2_CORE: C?#12.2 C?#13.2 C?#33.2 C?#34.2 C?#35.2 C?#36.2 C?#37.2 C?#38.2 C?#39.2 C?#40.2 L?.2 R?#11.1 U?#4.5(VCCA12SSRX3) U?#4.13(VCCA12SSRX4) U?#4.24(VCCA12SSRX0) U?#4.30(VDD) U?#4.37(DC12FB) U?#4.48(VDD) U?#4.58(VDD) U?#4.61(VCCA12SSRX1) U?#4.68(VCCA12SSRX2) U?#4.74(VCCA12SSM)
VCC3V3_SYS: C?#18.2 C?#25.2 C?#26.2 C?#27.2 C?#28.2 C?#29.2 C?#30.2 C?#31.2 C?#32.2 R?#8.1 R?#9.1 R?#10.1 R?#13.2 R?#14.2 U?#4.2(VCCA33SSM) U?#4.8(VCCA33SS34) U?#4.18(DC33FB) U?#4.27(VCCA33SS0) U?#4.36(VSUS33) U?#4.41(VSUS33) U?#4.49(VSUS33) U?#4.71(VCCA33SS12)
VCC5V0_SYS: C?#14.2 C?#19.2 C?#20.2 C?#21.2 C?#22.2 C?#23.2 C?#24.2 R?#12.2 U?#4.19(VCC5I) U?#4.38(VCC5I)
EXTPWRON: R?#10.2 U?#4.47(EXTPWRON)
GRN1: R?#18.2 U?#4.53(USBHGRN1)
GRN2: R?#19.2 U?#4.52(USBHGRN2)
GRN3: R?#20.2 U?#4.51(USBHGRN3)
GRN4: R?#21.2 U?#4.50(USBHGRN4)
OVCUR1: R?#8.2 U?#4.45(USBHOC1#)
OVCUR2B: R?#9.2 U?#4.44(USBHOC2#)
RESET: C?#15.1 R?#13.1 U?#4.54(RESET#)
SPICSn: R?#14.1 R?#16.2 U?#4.32(USBHMBR4) ; port SPICSn
SPISCLK: U?#4.33(USBHMBR3) ; port SPISCLK
SPISI: U?#4.34(USBHMBR2) ; port SPISI
SPISO: U?#4.35(USBHMBR1) ; port SPISO
SSRX0_N: U?#4.25(SSRX0-) ; port SSRX0_N
SSRX0_P: U?#4.26(SSRX0+) ; port SSRX0_P
SSRX1_N: U?#4.63(SSRX1-) ; port SSRX1_N  [project net ASM1153_SSRX_N]
SSRX1_P: U?#4.62(SSRX1+) ; port SSRX1_P  [project net ASM1153_SSRX_P]
SSRX2_N: U?#4.70(SSRX2-) ; port SSRX2_N  [project net ASM1153_SSRX_N]
SSRX2_P: U?#4.69(SSRX2+) ; port SSRX2_P  [project net ASM1153_SSRX_P]
SSRX3_N: U?#4.7(SSRX3-) ; port SSRX3_N  [project net ASM1153_SSRX_N]
SSRX3_P: U?#4.6(SSRX3+) ; port SSRX3_P  [project net ASM1153_SSRX_P]
SSRX4_N: U?#4.15(SSRX4-) ; port SSRX4_N  [project net ASM1153_SSRX_N]
SSRX4_P: U?#4.14(SSRX4+) ; port SSRX4_P  [project net ASM1153_SSRX_P]
SSTX0_N: U?#4.22(SSTX0-) ; port SSTX0_N
SSTX0_P: U?#4.23(SSTX0+) ; port SSTX0_P
SSTX1_N: C?#5.2 U?#4.60(SSTX1-)
SSTX1_P: C?#4.2 U?#4.59(SSTX1+)
SSTX1_R_N: C?#5.1 ; port SSTX1_R_N  [project net ASM1153E_SSTX_N]
SSTX1_R_P: C?#4.1 ; port SSTX1_R_P  [project net ASM1153E_SSTX_P]
SSTX2_N: C?#7.2 U?#4.67(SSTX2-)
SSTX2_P: C?#6.2 U?#4.66(SSTX2+)
SSTX2_R_N: C?#7.1 ; port SSTX2_R_N  [project net ASM1153E_SSTX_N]
SSTX2_R_P: C?#6.1 ; port SSTX2_R_P  [project net ASM1153E_SSTX_P]
SSTX3_N: C?#9.2 U?#4.4(SSTX3-)
SSTX3_P: C?#8.2 U?#4.3(SSTX3+)
SSTX3_R_N: C?#9.1 ; port SSTX3_R_N  [project net ASM1153E_SSTX_N]
SSTX3_R_P: C?#8.1 ; port SSTX3_R_P  [project net ASM1153E_SSTX_P]
SSTX4_N: C?#11.2 U?#4.12(SSTX4-)
SSTX4_P: C?#10.2 U?#4.11(SSTX4+)
SSTX4_R_N: C?#11.1 ; port SSTX4_R_N  [project net ASM1153E_SSTX_N]
SSTX4_R_P: C?#10.1 ; port SSTX4_R_P  [project net ASM1153E_SSTX_P]
SSXI: C?#16.1 U?#4.75(SSXI) X?.3(OSC2)
SSXO: C?#17.1 U?#4.76(SSXO) X?.1(OSC1)
USBDP_N: U?#4.29(USBDP-) ; port USBDP_N
USBDP_P: U?#4.28(USBDP+) ; port USBDP_P
USBHP1_N: U?#4.65(USBHP1-) ; port USBHP1_N  [project net USB_Downstream_D_N]
USBHP1_P: U?#4.64(USBHP1+) ; port USBHP1_P  [project net USB_Downstream_D_P]
USBHP2_N: U?#4.73(USBHP2-) ; port USBHP2_N  [project net USB_Downstream_D_N]
USBHP2_P: U?#4.72(USBHP2+) ; port USBHP2_P  [project net USB_Downstream_D_P]
USBHP3_N: U?#4.10(USBHP3-) ; port USBHP3_N  [project net USB_Downstream_D_N]
USBHP3_P: U?#4.9(USBHP3+) ; port USBHP3_P  [project net USB_Downstream_D_P]
USBHP4_N: U?#4.17(USBHP4-) ; port USBHP4_N  [project net USB_Downstream_D_N]
USBHP4_P: U?#4.16(USBHP4+) ; port USBHP4_P  [project net USB_Downstream_D_P]
VBUSDET: R?#12.1 R?#15.2 U?#4.31(VBUSDET)
NetD?#1_1: D?#1.1(A) R?#18.1
NetD?#2_1: D?#2.1(A) R?#19.1
NetD?#3_1: D?#3.1(A) R?#20.1
NetD?#4_1: D?#4.1(A) R?#21.1
NetL?_1: L?.1 U?#4.39(LX)
NetR?#11_2: R?#11.2 U?#4.40(DC12FB)
NetR?#17_2: R?#17.2 U?#4.1(SSREXT)

Not connected (* = marked no-connect by the designer): U?#4 21(DC10FB)* 42(USBHPE2B#)* 43(USBHPE1#) 46(COREPWRDN#)* 55(SMCLK)* 56(SMDAT)*

### Layout directives
differential pair: SSTX1_N, SSTX1_P, SSTX2_N, SSTX2_P, SSTX3_N, SSTX3_P, SSTX4_N, SSTX4_P

### Notes on the sheet
- Reserved for VL812 rev B2 to simplify layout of DC12FB pin.
- 主控 VL813
- USBHPE1#:	Power Enable for Gangmode Ports
  Low: Port Power On.
  High: Port Power Off.
  USBHPE1#:	Power Enable for Gangmode Ports
  Low: Port Power On.
  High: Port Power Off.
  USBHOC1#:	DP1 Over Current Detect
  Low: Port Over Current
  High: Normal
  USBHOC2#	DP2 Over Current Detect
  Low: Port Over Current
  High: Normal
- (near C?#11) The capacitor of USB 3.0 TX path must placement near connector
- USB HUB part
- SPICSn:
  For internal ROM used.
  Pull up: BC Function used
  Pull low: Normal functio
- 滤波电路
- 模式切换
- D1,D2,D3,D4:
  Port接入指示灯
- VL813-USB3.0-HUB
- 1/1
- 2022-11-20-Ver.A
- Goodyuhuang

### Library data of the parts
C?#4-C?#11 C?#22-C?#40 = C0402: Capacitor; Published: 8-Jun-2000; LatestRevisionDate: 17-Jul-2002; LatestRevisionNote: Re-released for DXP Platform.; PackageReference: RAD-0.3; Publisher: Altium Limited; PackageDescription: Radial Cap, Thru-Hole; 2 Leads; 0.3 in Pin Spacing
C?#12-C?#14 C?#18 C?#19 = C0603: Capacitor; Published: 8-Jun-2000; LatestRevisionDate: 17-Jul-2002; LatestRevisionNote: Re-released for DXP Platform.; PackageReference: RAD-0.3; Publisher: Altium Limited; PackageDescription: Radial Cap, Thru-Hole; 2 Leads; 0.3 in Pin Spacing
C?#15-C?#17 = C: as C?#6 on sheet 3_USB-SATA; BOM_Supplier: LCSC; BOM_Supplier Part: C42998; BOM_JLCPCB Part Class: Extended Part; spicePre: C; spiceSymbolName: 0603F104M500NT
C?#20 C?#21 = C1206: CL31A476MPHNNNE; Published: 8-Jun-2000; LatestRevisionDate: 17-Jul-2002; LatestRevisionNote: Re-released for DXP Platform.; PackageReference: RAD-0.3; Publisher: Altium Limited; PackageDescription: Radial Cap, Thru-Hole; 2 Leads; 0.3 in Pin Spacing
D?#1-D?#4 = 17-21SURC/S530-A3/TR8: BOM_Manufacturer: EVERLIGHT; BOM_Supplier: LCSC; BOM_Manufacturer Part: 17-21SURC/S530-A3/TR8; BOM_Supplier Part: C72037; BOM_JLCPCB Part Class: Extended Part; spicePre: L; spiceSymbolName: 17-21SURC/S530-A3/TR8
L? = L: BOM_Manufacturer Part: VHF160808H33NJT; BOM_Manufacturer: FH; nameAlias: Inductance; BOM_Supplier: LCSC; BOM_Supplier Part: C90209; BOM_JLCPCB Part Class: Extended Part; spicePre: L; spiceSymbolName: VHF160808H33NJT
R?#8-R?#10 R?#12-R?#16 = R0402: Resistor; Published: 8-Jun-2000; LatestRevisionDate: 17-Jul-2002; LatestRevisionNote: Re-released for DXP Platform.; PackageReference: AXIAL-0.3; Publisher: Altium Limited; PackageDescription: Axial Device, Thru-Hole; 2 Leads; 0.3 in Pin Spacing
R?#11 R?#18-R?#21 = R0603: Resistor; Published: 8-Jun-2000; LatestRevisionDate: 17-Jul-2002; LatestRevisionNote: Re-released for DXP Platform.; PackageReference: AXIAL-0.3; Publisher: Altium Limited; PackageDescription: Axial Device, Thru-Hole; 2 Leads; 0.3 in Pin Spacing
R?#17 = R0402: RC0402FR-076K04L; Published: 8-Jun-2000; LatestRevisionDate: 17-Jul-2002; LatestRevisionNote: Re-released for DXP Platform.; PackageReference: AXIAL-0.3; Publisher: Altium Limited; PackageDescription: Axial Device, Thru-Hole; 2 Leads; 0.3 in Pin Spacing
U?#4 = VL813(A1): Manufacturer: VIA(台湾威盛电子); Symbol: VL813(A1)_C209755; Add into BOM: yes; Name: VL813(A1); Device: VL813(A1); LCSC Part Name: VL813(A1); Supplier Part: C209755; Manufacturer Part: VL813(A1); Supplier Footprint: QFN-76_9x9x04P; JLCPCB Part Class: Extended Part; Datasheet: https://atta.szlcsc.com/upload/public/pdf/source/20180420/C209755_1BF0F45DD04BFA941B7FD492504FA511.pdf; Supplier: LCSC; Convert to PCB: yes; Type: -; Protocol: -; Number of Drivers/Receivers: -; Data Rate: -; Supply Voltage: -
X? = XTAL_3225_40M: BOM_Manufacturer: YXC; BOM_Manufacturer Part: X322540MPB4SI; nameAlias: Frequency; BOM_Supplier: LCSC; BOM_Supplier Part: C9010; BOM_JLCPCB Part Class: Extended Part; spicePre: X; spiceSymbolName: X322540MPB4SI

## Sheet 1_Power.SchDoc
size A4
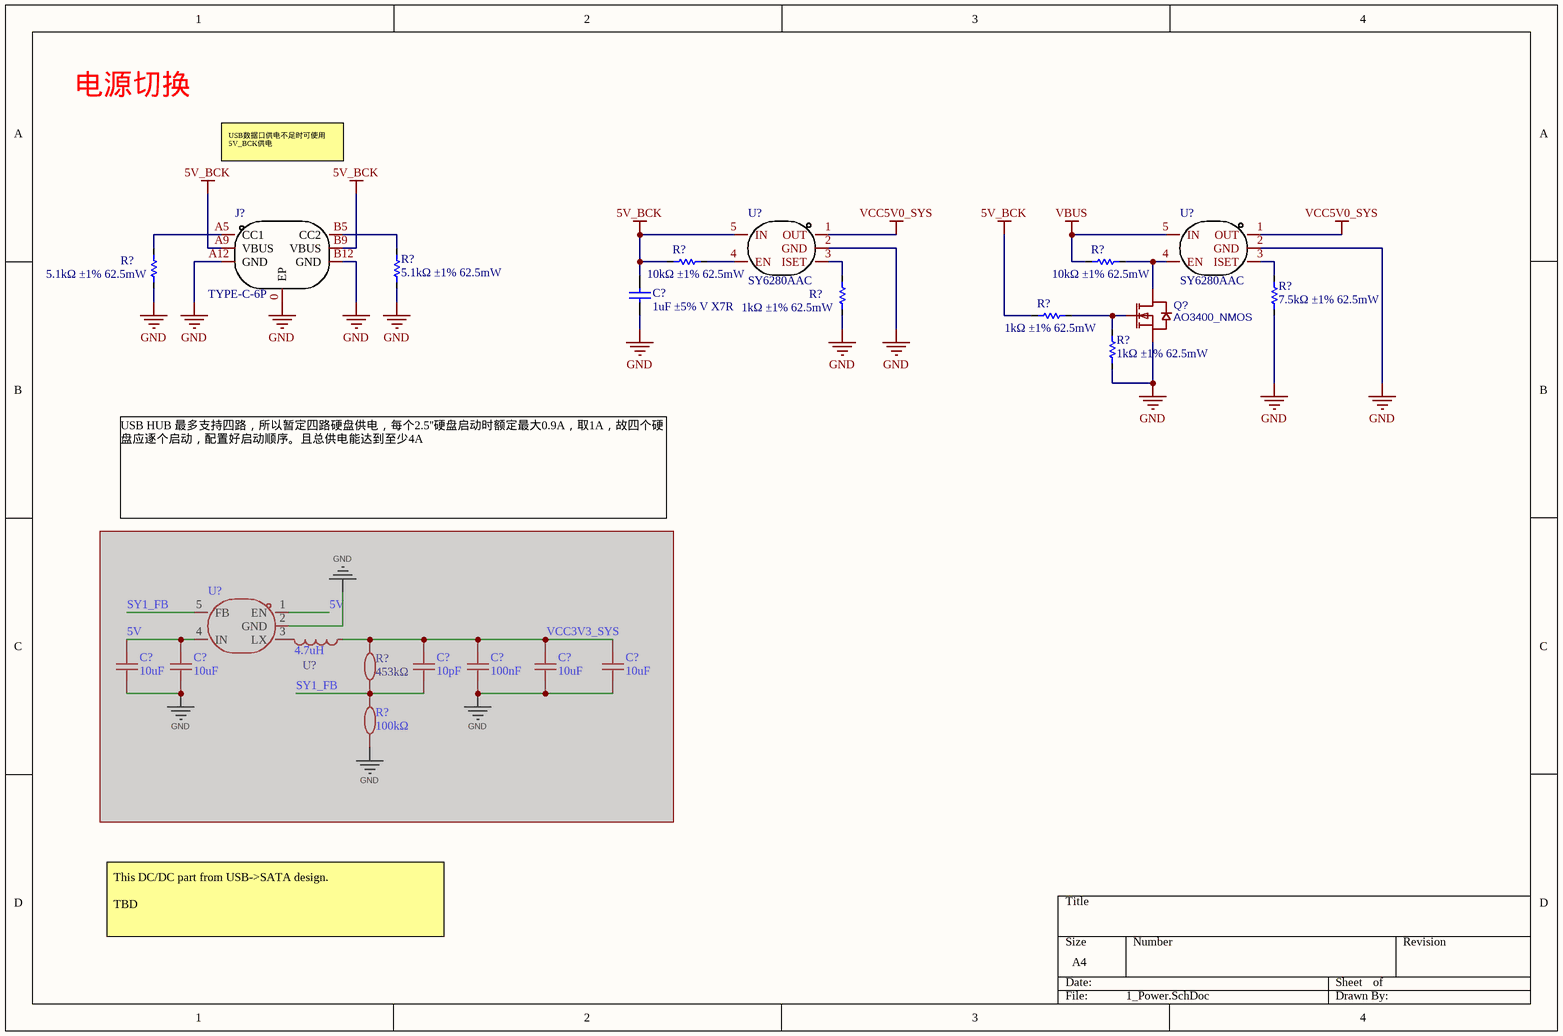
[diagram p6: 1_Power.SchDoc]

### Parts
(Parts that share a designator on the sheet are numbered #1, #2 ... from top to bottom, then left to right.)
C?#41  1uF ±5% V X7R  [C0402]
C?#42  10uF  [C0603]  (masked out: inside a compile mask, not in the netlist)
C?#43  10uF  [C0603]  (masked out: inside a compile mask, not in the netlist)
C?#44  10pF  [C0402]  (masked out: inside a compile mask, not in the netlist)
C?#45  100nF  [C0402]  (masked out: inside a compile mask, not in the netlist)
C?#46  10uF  [C0603]  (masked out: inside a compile mask, not in the netlist)
C?#47  10uF  [C0603]  (masked out: inside a compile mask, not in the netlist)
J?  TYPE-C-6P  [TYPE-C-6P]
Q?  AO3400_NMOS  [SOT-23-3_L2.9-W1.3-P1.90-LS2.4-BR]
R?#22  10kΩ ±1% 62.5mW  [R0402]
R?#23  10kΩ ±1% 62.5mW  [R0402]
R?#24  5.1kΩ ±1% 62.5mW  [R0402]
R?#25  5.1kΩ ±1% 62.5mW  [R0402]
R?#26  1kΩ ±1% 62.5mW  [R0402]
R?#27  7.5kΩ ±1% 62.5mW  [R0402]
R?#28  1kΩ ±1% 62.5mW  [R0402]
R?#29  1kΩ ±1% 62.5mW  [R0402]
R?#30  453kΩ  [R0402]  (masked out: inside a compile mask, not in the netlist)
R?#31  100kΩ  [R0402]  (masked out: inside a compile mask, not in the netlist)
U?#5  SY6280AAC  [SOT-23-5_L3.0-W1.7-P0.95-LS2.8-BR]
U?#6  SY6280AAC  [SOT-23-5_L3.0-W1.7-P0.95-LS2.8-BR]
U?#7  SY8089A1AAC  [TSOT-23-5_L2.9-W1.6-P0.95-LS2.8-BR]  (value not drawn)  (masked out: inside a compile mask, not in the netlist)
U?#8  4.7uH  [IND-SMD_L4.0-W4.0]  (masked out: inside a compile mask, not in the netlist)

### Nets
5V_BCK: C?#41.2 J?.A9(VBUS) J?.B9(VBUS) R?#22.2 R?#28.2 U?#5.5(IN)
GND: C?#41.1 J?.0(EP) J?.A12(GND) J?.B12(GND) Q?.2(S) R?#24.1 R?#25.1 R?#26.1 R?#27.2 R?#29.2 U?#5.2(GND) U?#6.2(GND)
VBUS: R?#23.2 U?#6.5(IN)
VCC5V0_SYS: U?#5.1(OUT) U?#6.1(OUT)
NetJ?_A5: J?.A5(CC1) R?#24.2
NetJ?_B5: J?.B5(CC2) R?#25.2
NetQ?_1: Q?.1(G) R?#28.1 R?#29.1
NetQ?_3: Q?.3(D) R?#23.1 U?#6.4(EN)
NetR?#22_1: R?#22.1 U?#5.4(EN)
NetR?#26_2: R?#26.2 U?#5.3(ISET)
NetR?#27_1: R?#27.1 U?#6.3(ISET)

### Notes on the sheet
- 电源切换
- USB数据口供电不足时可使用5V_BCK供电
- USB HUB 最多支持四路，所以暂定四路硬盘供电，每个2.5''硬盘启动时额定最大0.9A，取1A，故四个硬盘应逐个启动，配置好启动顺序。且总供电能达到至少4A
- This DC/DC part from USB->SATA design.
  TBD

### Library data of the parts
C?#41 = C0402: Capacitor; Published: 8-Jun-2000; LatestRevisionDate: 17-Jul-2002; LatestRevisionNote: Re-released for DXP Platform.; PackageReference: RAD-0.3; Publisher: Altium Limited; PackageDescription: Radial Cap, Thru-Hole; 2 Leads; 0.3 in Pin Spacing
C?#42 C?#43 C?#46 C?#47 = CL10A106KP8NNNC: as C?#7 on sheet 3_USB-SATA; Symbol: CL10A106KP8NNNC; Device: CL10A106KP8NNNC; LCSC Part Name: 10uF ±10% 10V; Supplier Part: C19702; Manufacturer Part: CL10A106KP8NNNC; Supplier Footprint: 0603; JLCPCB Part Class: Basic Part; Datasheet: https://atta.szlcsc.com/upload/public/pdf/source/20160103/1457707703378.pdf; Supplier: LCSC; Convert to PCB: yes; Value: 10uF
C?#44 = TCC0402COG100J500AT: Manufacturer: CCTC(三环); Add into BOM: yes; Tolerance: ±5%; Voltage Rated: 50V; Temperature Coefficient: C0G; Symbol: TCC0402COG100J500AT; Device: TCC0402COG100J500AT; LCSC Part Name: 10pF ±5% 50V; Supplier Part: C696913; Manufacturer Part: TCC0402COG100J500AT; Supplier Footprint: 0402; JLCPCB Part Class: Extended Part; Datasheet: https://atta.szlcsc.com/upload/public/pdf/source/20200707/C696841_89A2C111301AB76AE7642008585E7A11.pdf; Supplier: LCSC; Convert to PCB: yes; Value: 10pF
C?#45 = TCC0402X5R104M250AT: Manufacturer: CCTC(三环); Add into BOM: yes; Tolerance: ±20%; Voltage Rated: 25V; Temperature Coefficient: X5R; Symbol: TCC0402X5R104M250AT; Device: TCC0402X5R104M250AT; LCSC Part Name: 100nF ±20% 25V; Supplier Part: C359190; Manufacturer Part: TCC0402X5R104M250AT; Supplier Footprint: 0402; JLCPCB Part Class: Extended Part; Datasheet: https://atta.szlcsc.com/upload/public/pdf/source/20190103/C359190_40860758378AF13613616C0AB9EED028.pdf; Supplier: LCSC; Convert to PCB: yes; Value: 100nF
Q? = AO3400_C841146: BOM_Manufacturer: LGE; BOM_Manufacturer Part: AO3400; Contributor: LCSC; BOM_Supplier: LCSC; BOM_Supplier Part: C841146; BOM_JLCPCB Part Class: Extended Part; spicePre: Q; spiceSymbolName: AO3400_C841146
R?#22-R?#29 = R0402: Resistor; Published: 8-Jun-2000; LatestRevisionDate: 17-Jul-2002; LatestRevisionNote: Re-released for DXP Platform.; PackageReference: AXIAL-0.3; Publisher: Altium Limited; PackageDescription: Axial Device, Thru-Hole; 2 Leads; 0.3 in Pin Spacing
R?#30 = 0402WGF4533TCE: Manufacturer: UNI-ROYAL(厚声); Add into BOM: yes; Tolerance: ±1%; Power(Watts): 62.5mW; Overload Voltage (Max): 50V; Temperature Coefficient: ±100ppm/℃; Symbol: 0402WGF4533TCE; Device: 0402WGF4533TCE; Supplier: LCSC; Manufacturer Part: 0402WGF4533TCE; Value: 453kΩ; Supplier Part: C27009; JLCPCB Part Class: Extended Part; LCSC Part Name: 453kΩ ±1% 62.5mW 厚膜电阻; Supplier Footprint: 0402; Datasheet: https://atta.szlcsc.com/upload/public/pdf/source/20200306/C422600_1E6D84923E4A46A82E41ADD87F860B5C.pdf; Convert to PCB: yes; Type: 厚膜电阻; Operating Temperature Range: -55℃~+155℃
R?#31 = CR0402JF0104G: Manufacturer: LIZ(丽智电子); Add into BOM: yes; Tolerance: ±5%; Power(Watts): 62.5mW; Temperature Coefficient: ±200ppm/; Overload Voltage (Max): 50V; Symbol: CR0402JF0104G; Device: CR0402JF0104G; LCSC Part Name: 100kΩ ±5% 62.5mW; Supplier Part: C100573; Manufacturer Part: CR0402JF0104G; Supplier Footprint: 0402; JLCPCB Part Class: Extended Part; Datasheet: https://atta.szlcsc.com/upload/public/pdf/source/20170408/1491631220702.pdf; Supplier: LCSC; Convert to PCB: yes; Type: 厚膜电阻; Value: 100kΩ; Operating Temperature Range: -55~+125
U?#7 = SY8089A1AAC: Manufacturer: silergy(矽力杰); Add into BOM: yes; Symbol: SY8089A1AAC; Device: SY8089A1AAC; LCSC Part Name: SY8089A1AAC; Supplier Part: C479074; Manufacturer Part: SY8089A1AAC; Supplier Footprint: SOT-23-5; JLCPCB Part Class: 扩展库; Datasheet: https://atta.szlcsc.com/upload/public/pdf/source/20200117/C479074_09E605B8BDE11DB5A08573B7E6429A0D.pdf; Supplier: LCSC; Convert to PCB: yes
U?#8 = SFE4030A-4R7M-F-HF: Manufacturer: DDY(德立); Add into BOM: yes; Tolerance: ±20%; Rated Current: 2.3A; Saturation Current (Isat): 3.2A; DC Resistance (DCR): 67mΩ; Symbol: SFE4030A-4R7M-F-HF; Device: SFE4030A-4R7M-F-HF; LCSC Part Name: 4.7uH ±20% 3.2A; Supplier Part: C5159670; Manufacturer Part: SFE4030A-4R7M-F-HF; Supplier Footprint: SMD,4x4mm; JLCPCB Part Class: 扩展库; Datasheet: https://atta.szlcsc.com/upload/public/pdf/source/20221009/E6A1C7112975AA831F7D1355BB828BA7.pdf; Supplier: LCSC; Convert to PCB: yes; Value: 4.7uH

## Nets that join several sheets
GND: U_3_USB-SATA1 (47 pins), U_3_USB-SATA2 (47 pins), U_3_USB-SATA3 (47 pins), U_3_USB-SATA4 (47 pins), 5_FLASH (C?#1.1 U?#1.4), 4_INPUT (16 pins), 2_Main (41 pins), 1_Power (12 pins)
VBUS: 4_INPUT (5 pins), 1_Power (R?#23.2 U?#6.5)
VCC1V2_CORE: U_3_USB-SATA1 (14 pins), U_3_USB-SATA2 (14 pins), U_3_USB-SATA3 (14 pins), U_3_USB-SATA4 (14 pins), 2_Main (22 pins)
VCC3V3_SYS: U_3_USB-SATA1 (25 pins), U_3_USB-SATA2 (25 pins), U_3_USB-SATA3 (25 pins), U_3_USB-SATA4 (25 pins), 5_FLASH (C?#1.2 U?#1.3 U?#1.7 U?#1.8), 2_Main (22 pins)
VCC5V0_SYS: U_3_USB-SATA1 (7 pins), U_3_USB-SATA2 (7 pins), U_3_USB-SATA3 (7 pins), U_3_USB-SATA4 (7 pins), 4_INPUT (6 pins), 2_Main (10 pins), 1_Power (U?#5.1 U?#6.1)
ASM1153_SSRX_N: U_3_USB-SATA1 (U?_U_3_USB-SATA1#4.22), 2_Main (U?#4.63)
ASM1153_SSRX_N: U_3_USB-SATA2 (U?_U_3_USB-SATA2#4.22), 2_Main (U?#4.70)
ASM1153_SSRX_N: U_3_USB-SATA3 (U?_U_3_USB-SATA3#4.22), 2_Main (U?#4.7)
ASM1153_SSRX_N: U_3_USB-SATA4 (U?_U_3_USB-SATA4#4.22), 2_Main (U?#4.15)
ASM1153_SSRX_P: U_3_USB-SATA1 (U?_U_3_USB-SATA1#4.23), 2_Main (U?#4.62)
ASM1153_SSRX_P: U_3_USB-SATA2 (U?_U_3_USB-SATA2#4.23), 2_Main (U?#4.69)
ASM1153_SSRX_P: U_3_USB-SATA3 (U?_U_3_USB-SATA3#4.23), 2_Main (U?#4.6)
ASM1153_SSRX_P: U_3_USB-SATA4 (U?_U_3_USB-SATA4#4.23), 2_Main (U?#4.14)
ASM1153E_SSTX_N: U_3_USB-SATA1 (C?_U_3_USB-SATA1#9.1 U?_U_3_USB-SATA1#4.19), 2_Main (C?#5.1)
ASM1153E_SSTX_N: U_3_USB-SATA2 (C?_U_3_USB-SATA2#9.1 U?_U_3_USB-SATA2#4.19), 2_Main (C?#7.1)
ASM1153E_SSTX_N: U_3_USB-SATA3 (C?_U_3_USB-SATA3#9.1 U?_U_3_USB-SATA3#4.19), 2_Main (C?#9.1)
ASM1153E_SSTX_N: U_3_USB-SATA4 (C?_U_3_USB-SATA4#9.1 U?_U_3_USB-SATA4#4.19), 2_Main (C?#11.1)
ASM1153E_SSTX_P: U_3_USB-SATA1 (C?_U_3_USB-SATA1#8.1 U?_U_3_USB-SATA1#4.20), 2_Main (C?#4.1)
ASM1153E_SSTX_P: U_3_USB-SATA2 (C?_U_3_USB-SATA2#8.1 U?_U_3_USB-SATA2#4.20), 2_Main (C?#6.1)
ASM1153E_SSTX_P: U_3_USB-SATA3 (C?_U_3_USB-SATA3#8.1 U?_U_3_USB-SATA3#4.20), 2_Main (C?#8.1)
ASM1153E_SSTX_P: U_3_USB-SATA4 (C?_U_3_USB-SATA4#8.1 U?_U_3_USB-SATA4#4.20), 2_Main (C?#10.1)
SPICSn: 5_FLASH (U?#1.1), 2_Main (R?#14.1 R?#16.2 U?#4.32)
SPISCLK: 5_FLASH (U?#1.6), 2_Main (U?#4.33)
SPISI: 5_FLASH (U?#1.5), 2_Main (U?#4.34)
SPISO: 5_FLASH (U?#1.2), 2_Main (U?#4.35)
SSRX0_N: 4_INPUT (U?#3.18), 2_Main (U?#4.25)
SSRX0_P: 4_INPUT (U?#3.17), 2_Main (U?#4.26)
SSTX0_N: 4_INPUT (U?#3.21), 2_Main (U?#4.22)
SSTX0_P: 4_INPUT (U?#3.20), 2_Main (U?#4.23)
USB_Downstream_D_N: U_3_USB-SATA1 (U?_U_3_USB-SATA1#4.16), 2_Main (U?#4.65)
USB_Downstream_D_N: U_3_USB-SATA2 (U?_U_3_USB-SATA2#4.16), 2_Main (U?#4.73)
USB_Downstream_D_N: U_3_USB-SATA3 (U?_U_3_USB-SATA3#4.16), 2_Main (U?#4.10)
USB_Downstream_D_N: U_3_USB-SATA4 (U?_U_3_USB-SATA4#4.16), 2_Main (U?#4.17)
USB_Downstream_D_P: U_3_USB-SATA1 (U?_U_3_USB-SATA1#4.15), 2_Main (U?#4.64)
USB_Downstream_D_P: U_3_USB-SATA2 (U?_U_3_USB-SATA2#4.15), 2_Main (U?#4.72)
USB_Downstream_D_P: U_3_USB-SATA3 (U?_U_3_USB-SATA3#4.15), 2_Main (U?#4.9)
USB_Downstream_D_P: U_3_USB-SATA4 (U?_U_3_USB-SATA4#4.15), 2_Main (U?#4.16)
USBDP_N: 4_INPUT (U?#2.A7 U?#2.B7), 2_Main (U?#4.29)
USBDP_P: 4_INPUT (U?#2.A6 U?#2.B6), 2_Main (U?#4.28)